# EAGLE design k1-v40 (EAGLE 5.01)

## Sheet 1 of 4
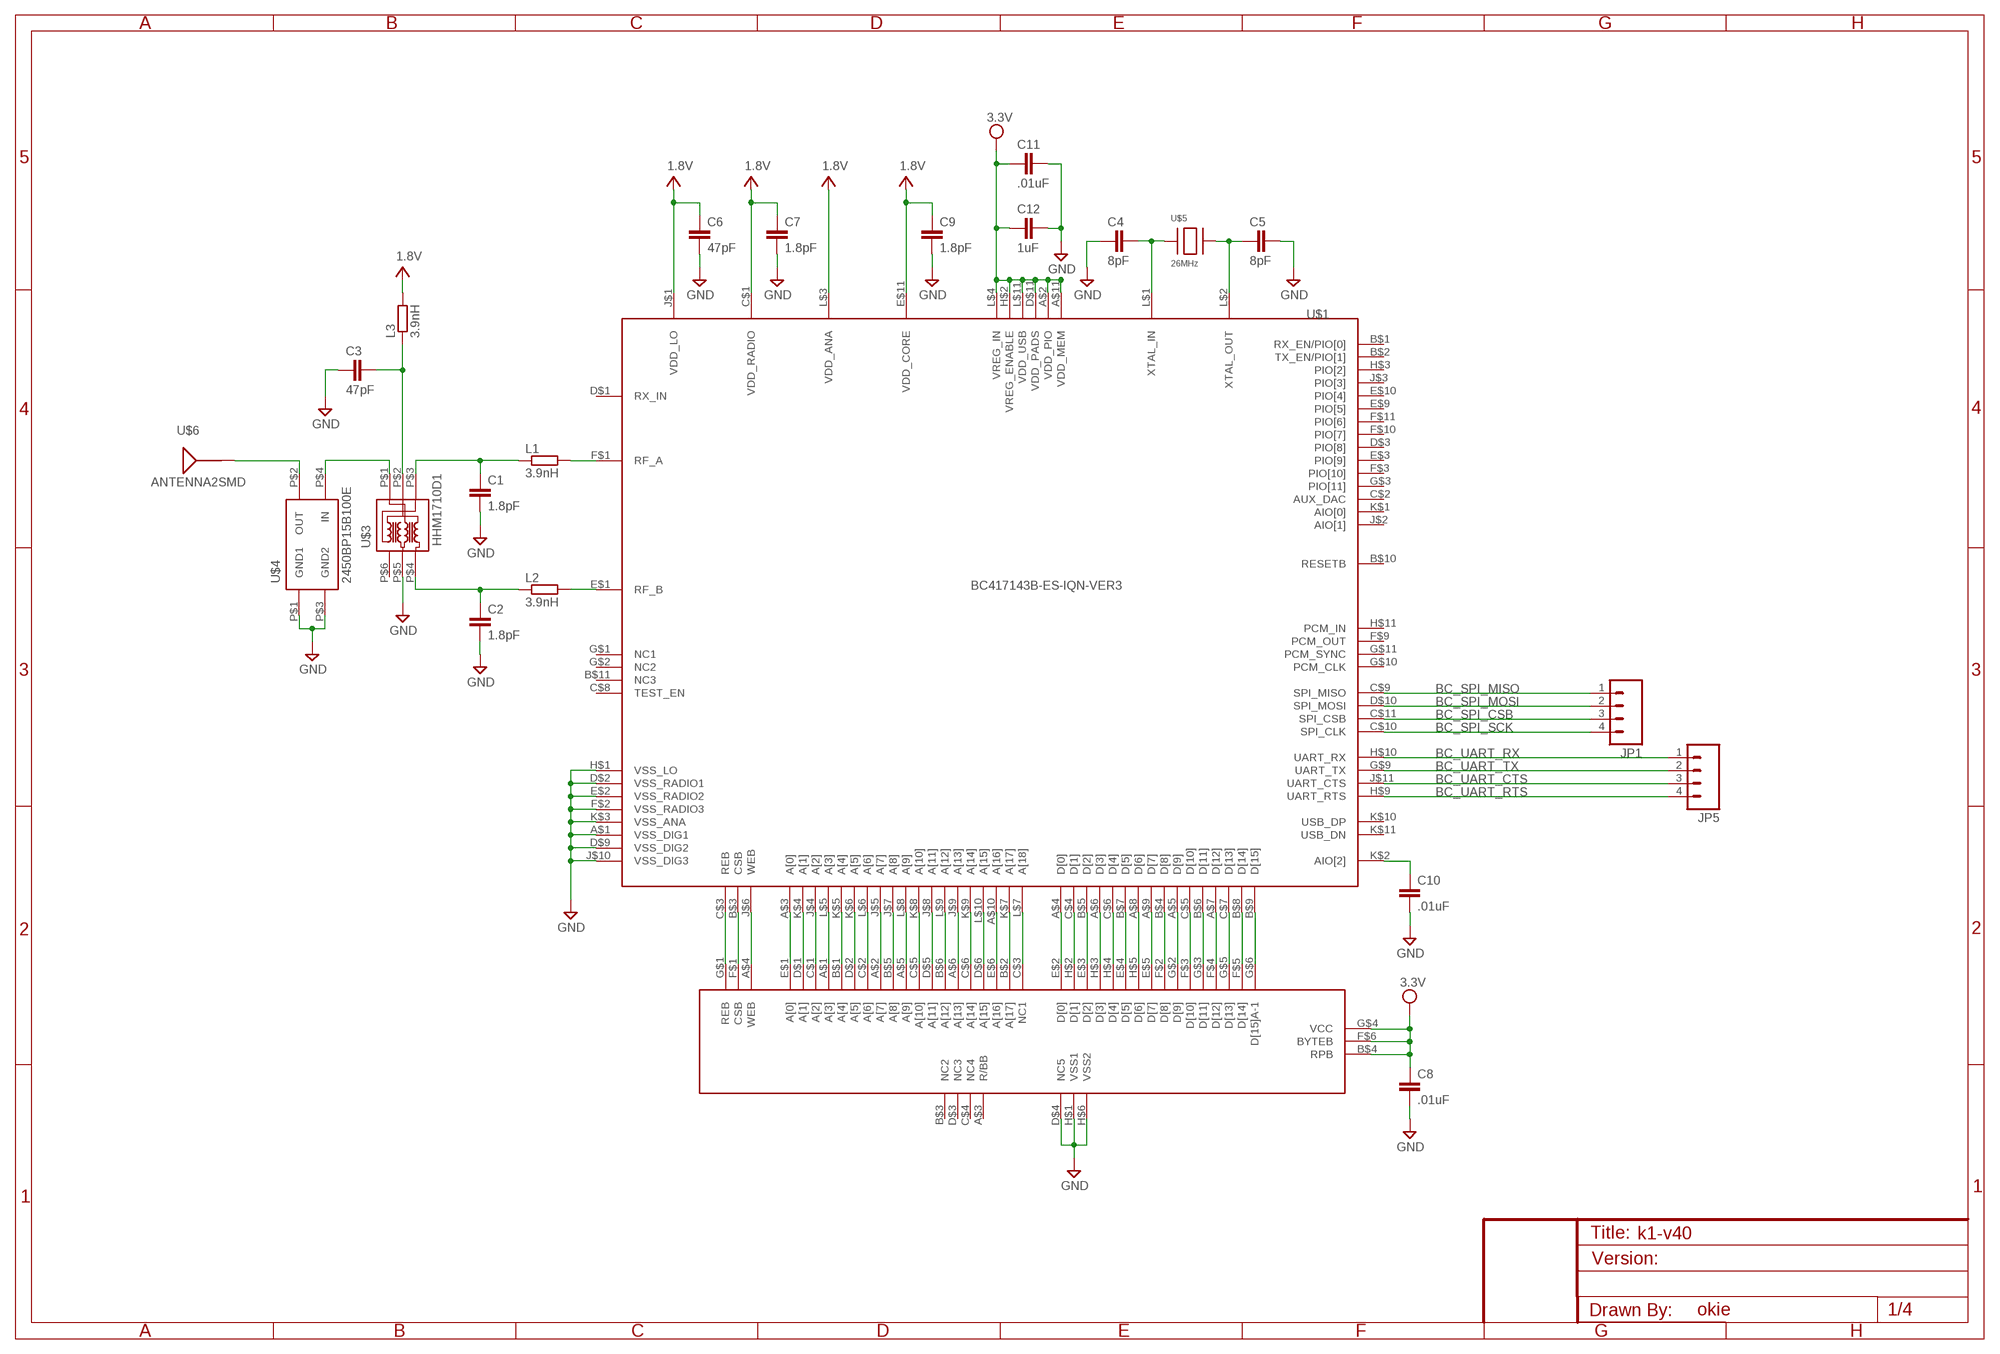
[diagram p0: schematic, sheet 1]

### Parts
C1  1.8pF  C-EUC0402  [C0402]
C2  1.8pF  C-EUC0402  [C0402]
C3  47pF  C-EUC0402  [C0402]
C4  8pF  C-EUC0402  [C0402]
C5  8pF  C-EUC0402  [C0402]
C6  47pF  C-EUC0402  [C0402]
C7  1.8pF  C-EUC0402  [C0402]
C8  .01uF  C-EUC0402  [C0402]
C9  1.8pF  C-EUC0402  [C0402]
C10  .01uF  C-EUC0402  [C0402]
C11  .01uF  C-EUC0402  [C0402]
C12  1uF  C-EUC0805  [C0805]
JP1  M04PTH  [1X04]
JP5  M04PTH  [1X04]
L1  3.9nH  R-EU_R0402  [R0402]
L2  3.9nH  R-EU_R0402  [R0402]
L3  3.9nH  R-EU_R0402  [R0402]
U$1  BC417143B-ES-IQN-VER3  [96-TFBGA-VER3]
U$2  M29W800DB  [48-TFBGA]
U$3  HHM1710D1  [HHM1710D1]
U$4  2450BP15B100E  [2450BP15B100E]
U$5  26MHz  3.2X2.5XTAL  [3.2X2.5XTAL]
U$6  ANTENNA2SMD  [ANTENNA-CHIP2]

### Nets
1.8V: C6.1 C7.1 C9.1 L3.2 U$1.C$1(VDD_RADIO) U$1.E$11(VDD_CORE) U$1.J$1(VDD_LO) U$1.L$3(VDD_ANA)
3.3V [vcc]: C8.1 C11.1 C12.1 U$1.A$2(VDD_PIO) U$1.A$11(VDD_MEM) U$1.D$11(VDD_PADS) U$1.H$2(VREG_ENABLE) U$1.L$4(VREG_IN) U$1.L$11(VDD_USB) U$2.B$4(RPB) U$2.F$6(BYTEB) U$2.G$4(VCC) ; also sheet 2,3,4
BC_SPI_CSB: JP1.3 U$1.C$11(SPI_CSB)
BC_SPI_MISO: JP1.1 U$1.C$9(SPI_MISO)
BC_SPI_MOSI: JP1.2 U$1.D$10(SPI_MOSI)
BC_SPI_SCK: JP1.4 U$1.C$10(SPI_CLK)
BC_UART_CTS: JP5.3 U$1.J$11(UART_CTS) ; also sheet 2
BC_UART_RTS: JP5.4 U$1.H$9(UART_RTS) ; also sheet 2
BC_UART_RX: JP5.1 U$1.H$10(UART_RX) ; also sheet 2
BC_UART_TX: JP5.2 U$1.G$9(UART_TX) ; also sheet 2
GND: C1.2 C2.2 C3.1 C4.1 C5.2 C6.2 C7.2 C8.2 C9.2 C10.2 C11.2 C12.2 U$1.A$1(VSS_DIG1) U$1.D$2(VSS_RADIO1) U$1.D$9(VSS_DIG2) U$1.E$2(VSS_RADIO2) U$1.F$2(VSS_RADIO3) U$1.H$1(VSS_LO) U$1.J$10(VSS_DIG3) U$1.K$3(VSS_ANA) U$2.D$4(NC5) U$2.H$1(VSS1) U$2.H$6(VSS2) U$3.P$5 U$4.P$1(GND1) U$4.P$3(GND2) ; also sheet 2,3,4
N$1: U$1.C$3(REB) U$2.G$1(REB)
N$2: U$1.B$3(CSB) U$2.F$1(CSB)
N$3: U$1.J$6(WEB) U$2.A$4(WEB)
N$4: U$1.A$3(A[0]) U$2.E$1(A[0])
N$5: U$1.K$4(A[1]) U$2.D$1(A[1])
N$6: U$1.J$4(A[2]) U$2.C$1(A[2])
N$7: U$1.L$5(A[3]) U$2.A$1(A[3])
N$8: U$1.K$5(A[4]) U$2.B$1(A[4])
N$9: U$1.K$6(A[5]) U$2.D$2(A[5])
N$10: U$1.L$6(A[6]) U$2.C$2(A[6])
N$11: U$1.J$5(A[7]) U$2.A$2(A[7])
N$12: U$1.J$7(A[8]) U$2.B$5(A[8])
N$13: U$1.L$8(A[9]) U$2.A$5(A[9])
N$14: U$1.K$8(A[10]) U$2.C$5(A[10])
N$15: U$1.J$8(A[11]) U$2.D$5(A[11])
N$16: U$1.L$9(A[12]) U$2.B$6(A[12])
N$17: U$1.J$9(A[13]) U$2.A$6(A[13])
N$18: U$1.K$9(A[14]) U$2.C$6(A[14])
N$19: U$1.L$10(A[15]) U$2.D$6(A[15])
N$20: U$1.A$10(A[16]) U$2.E$6(A[16])
N$21: U$1.K$7(A[17]) U$2.B$2(A[17])
N$22: U$1.L$7(A[18]) U$2.C$3(NC1)
N$23: U$1.A$4(D[0]) U$2.E$2(D[0])
N$24: U$1.C$4(D[1]) U$2.H$2(D[1])
N$25: U$1.B$5(D[2]) U$2.E$3(D[2])
N$26: U$1.A$6(D[3]) U$2.H$3(D[3])
N$27: U$1.C$6(D[4]) U$2.H$4(D[4])
N$28: U$1.B$7(D[5]) U$2.E$4(D[5])
N$29: U$1.A$8(D[6]) U$2.H$5(D[6])
N$30: U$1.A$9(D[7]) U$2.E$5(D[7])
N$31: U$1.B$4(D[8]) U$2.F$2(D[8])
N$32: U$1.A$5(D[9]) U$2.G$2(D[9])
N$33: U$1.C$5(D[10]) U$2.F$3(D[10])
N$34: U$1.B$6(D[11]) U$2.G$3(D[11])
N$35: U$1.A$7(D[12]) U$2.F$4(D[12])
N$36: U$1.C$7(D[13]) U$2.G$5(D[13])
N$37: U$1.B$8(D[14]) U$2.F$5(D[14])
N$38: U$1.B$9(D[15]) U$2.G$6(D[15]A-1)
N$39: C1.1 L1.1 U$3.P$3
N$40: L1.2 U$1.F$1(RF_A)
N$41: L2.2 U$1.E$1(RF_B)
N$42: C2.1 L2.1 U$3.P$4
N$43: C3.2 L3.1 U$3.P$2
N$44: U$3.P$1 U$4.P$4(IN)
N$45: C4.2 U$1.L$1(XTAL_IN) U$5.P$1
N$46: C5.1 U$1.L$2(XTAL_OUT) U$5.P$3
N$47: C10.1 U$1.K$2(AIO[2])
N$62: U$4.P$2(OUT) U$6.FEED(SIGNAL)
Unconnected: U$1.B$1(RX_EN/PIO[0]) U$1.B$2(TX_EN/PIO[1]) U$1.B$10(RESETB) U$1.B$11(NC3) U$1.C$2(AUX_DAC) U$1.C$8(TEST_EN) U$1.D$1(RX_IN) U$1.D$3(PIO[8]) U$1.E$3(PIO[9]) U$1.E$9(PIO[5]) U$1.E$10(PIO[4]) U$1.F$3(PIO[10]) U$1.F$9(PCM_OUT) U$1.F$10(PIO[7]) U$1.F$11(PIO[6]) U$1.G$1(NC1) U$1.G$2(NC2) U$1.G$3(PIO[11]) U$1.G$10(PCM_CLK) U$1.G$11(PCM_SYNC) U$1.H$3(PIO[2]) U$1.H$11(PCM_IN) U$1.J$2(AIO[1]) U$1.J$3(PIO[3]) U$1.K$1(AIO[0]) U$1.K$10(USB_DP) U$1.K$11(USB_DN) U$2.A$3(R/BB) U$2.B$3(NC2) U$2.C$4(NC4) U$2.D$3(NC3) U$3.P$6

### Notes on the sheet
- okie

## Sheet 2 of 4
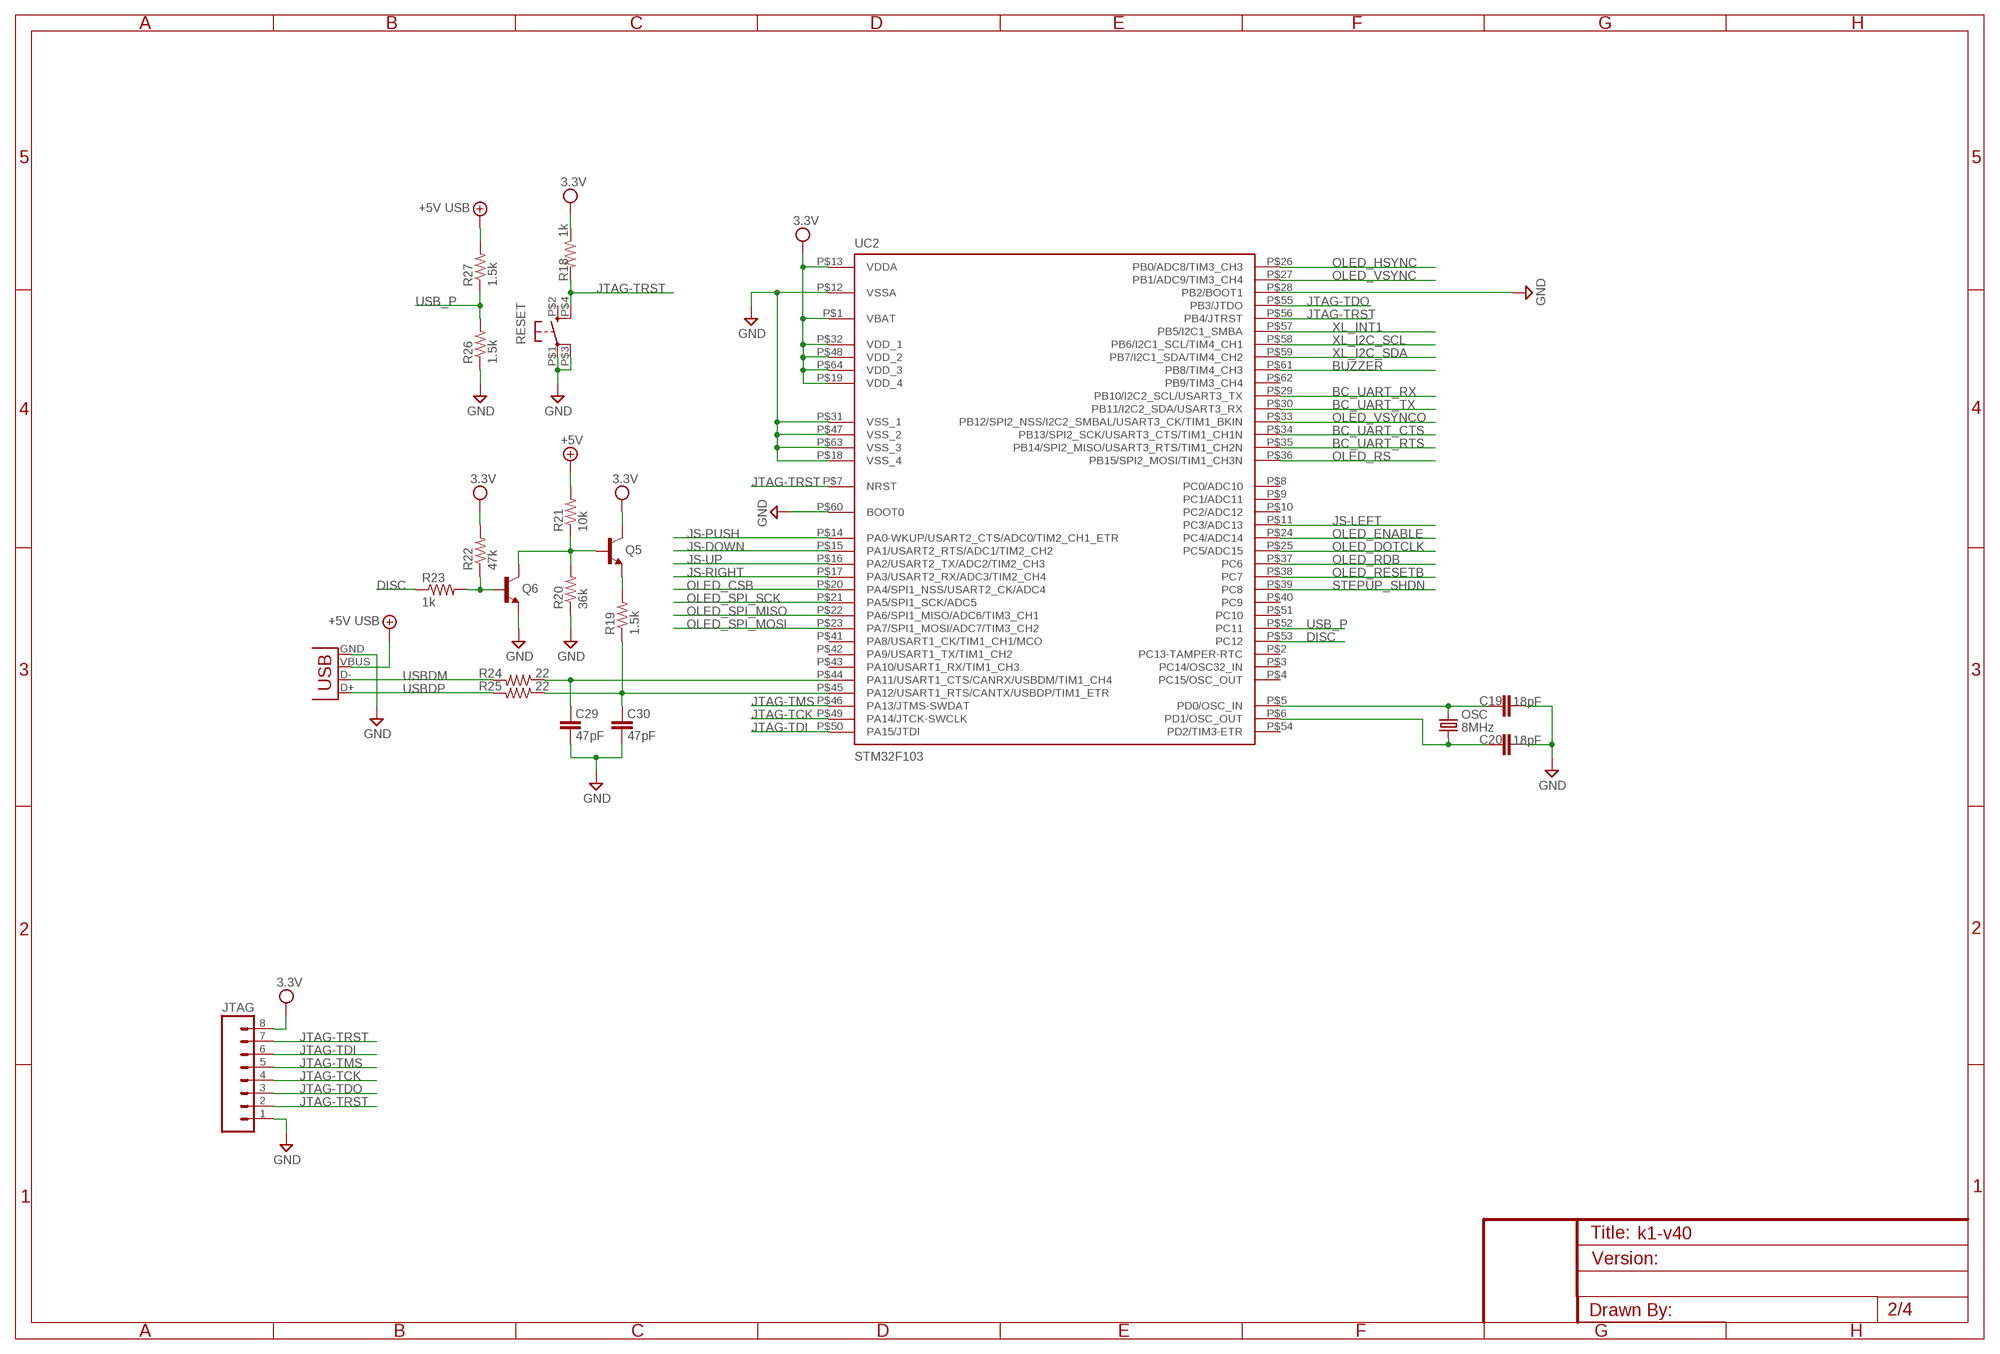
[diagram p1: schematic, sheet 2]

### Parts
C19  18pF  CAP0402  [C0402]
C20  18pF  CAP0402  [C0402]
C29  47pF  CAP0402  [C0402]
C30  47pF  CAP0402  [C0402]
JTAG  M08  [1X08]
OSC  8MHz  CRYSTAL5X3  [CRYSTAL-SMD-5X3]
Q5  TRANSISTOR_NPNSOT23  [SOT23]
Q6  TRANSISTOR_NPNSOT23  [SOT23]
R18  1k  RESISTOR0402  [C0402]
R19  1.5k  RESISTOR0402  [C0402]
R20  36k  RESISTOR0402  [C0402]
R21  10k  RESISTOR0402  [C0402]
R22  47k  RESISTOR0402  [C0402]
R23  1k  RESISTOR0402  [C0402]
R24  22  RESISTOR0402  [C0402]
R25  22  RESISTOR0402  [C0402]
R26  1.5k  RESISTOR0402  [C0402]
R27  1.5k  RESISTOR0402  [C0402]
RESET  BUTTON-KMR241GLFS  [PUSHBUTTON-KMR241GLFS]
UC2  STM32F103  [TQFP-10X10-64]
X1  USBSMD  [USB-MINIB]

### Nets
3.3V [vcc]: JTAG.8 Q5.3(C) R18.1 R22.2 UC2.P$1(VBAT) UC2.P$13(VDDA) UC2.P$19(VDD_4) UC2.P$32(VDD_1) UC2.P$48(VDD_2) UC2.P$64(VDD_3) ; also sheet 1,3,4
+5V: R21.2 R27.2 X1.VBUS ; supply symbol labelled +5V USB ; also sheet 4
BC_UART_CTS: UC2.P$34(PB13/SPI2_SCK/USART3_CTS/TIM1_CH1N) ; also sheet 1
BC_UART_RTS: UC2.P$35(PB14/SPI2_MISO/USART3_RTS/TIM1_CH2N) ; also sheet 1
BC_UART_RX: UC2.P$29(PB10/I2C2_SCL/USART3_TX) ; also sheet 1
BC_UART_TX: UC2.P$30(PB11/I2C2_SDA/USART3_RX) ; also sheet 1
BUZZER: UC2.P$61(PB8/TIM4_CH3) ; also sheet 3
DISC: R23.1 UC2.P$53(PC12)
GND: C19.1 C20.1 C29.1 C30.1 JTAG.1 Q6.2(E) R20.1 R26.1 RESET.P$1 RESET.P$3 UC2.P$12(VSSA) UC2.P$18(VSS_4) UC2.P$28(PB2/BOOT1) UC2.P$31(VSS_1) UC2.P$47(VSS_2) UC2.P$60(BOOT0) UC2.P$63(VSS_3) X1.GND ; also sheet 1,3,4
JS-DOWN: UC2.P$15(PA1/USART2_RTS/ADC1/TIM2_CH2) ; also sheet 3
JS-LEFT: UC2.P$11(PC3/ADC13) ; also sheet 3
JS-PUSH: UC2.P$14(PA0-WKUP/USART2_CTS/ADC0/TIM2_CH1_ETR) ; also sheet 3
JS-RIGHT: UC2.P$17(PA3/USART2_RX/ADC3/TIM2_CH4) ; also sheet 3
JS-UP: UC2.P$16(PA2/USART2_TX/ADC2/TIM2_CH3) ; also sheet 3
JTAG-TCK: JTAG.4 UC2.P$49(PA14/JTCK-SWCLK)
JTAG-TDI: JTAG.6 UC2.P$50(PA15/JTDI)
JTAG-TDO: JTAG.3 UC2.P$55(PB3/JTDO)
JTAG-TMS: JTAG.5 UC2.P$46(PA13/JTMS-SWDAT)
JTAG-TRST: JTAG.2 JTAG.7 R18.2 RESET.P$4 UC2.P$7(NRST) UC2.P$56(PB4/JTRST)
N$53: C19.2 OSC.3 UC2.P$5(PD0/OSC_IN)
N$54: C20.2 OSC.1 UC2.P$6(PD1/OSC_OUT)
N$55: Q5.2(E) R19.2
N$67: Q5.1(B) Q6.3(C) R20.2 R21.1
N$69: Q6.1(B) R22.1 R23.2
N$70: C29.2 R24.1 UC2.P$44(PA11/USART1_CTS/CANRX/USBDM/TIM1_CH4)
N$72: C30.2 R19.1 R25.1 UC2.P$45(PA12/USART1_RTS/CANTX/USBDP/TIM1_ETR)
OLED_CSB: UC2.P$20(PA4/SPI1_NSS/USART2_CK/ADC4) ; also sheet 3
OLED_DOTCLK: UC2.P$25(PC5/ADC15) ; also sheet 3
OLED_ENABLE: UC2.P$24(PC4/ADC14) ; also sheet 3
OLED_HSYNC: UC2.P$26(PB0/ADC8/TIM3_CH3) ; also sheet 3
OLED_RDB: UC2.P$37(PC6) ; also sheet 3
OLED_RESETB: UC2.P$38(PC7) ; also sheet 3
OLED_RS: UC2.P$36(PB15/SPI2_MOSI/TIM1_CH3N) ; also sheet 3
OLED_SPI_MISO: UC2.P$22(PA6/SPI1_MISO/ADC6/TIM3_CH1) ; also sheet 3
OLED_SPI_MOSI: UC2.P$23(PA7/SPI1_MOSI/ADC7/TIM3_CH2) ; also sheet 3
OLED_SPI_SCK: UC2.P$21(PA5/SPI1_SCK/ADC5) ; also sheet 3
OLED_VSYNC: UC2.P$27(PB1/ADC9/TIM3_CH4) ; also sheet 3
OLED_VSYNCO: UC2.P$33(PB12/SPI2_NSS/I2C2_SMBAL/USART3_CK/TIM1_BKIN) ; also sheet 3
STEPUP_SHDN: UC2.P$39(PC8) ; also sheet 4
USB_P: R26.2 R27.1 UC2.P$52(PC11)
USBDM: R24.2 X1.D-
USBDP: R25.2 X1.D+
XL_I2C_SCL: UC2.P$58(PB6/I2C1_SCL/TIM4_CH1) ; also sheet 3
XL_I2C_SDA: UC2.P$59(PB7/I2C1_SDA/TIM4_CH2) ; also sheet 3
XL_INT1: UC2.P$57(PB5/I2C1_SMBA) ; also sheet 3
Unconnected: RESET.P$2 UC2.P$2(PC13-TAMPER-RTC) UC2.P$3(PC14/OSC32_IN) UC2.P$4(PC15/OSC_OUT) UC2.P$8(PC0/ADC10) UC2.P$9(PC1/ADC11) UC2.P$10(PC2/ADC12) UC2.P$40(PC9) UC2.P$41(PA8/USART1_CK/TIM1_CH1/MCO) UC2.P$42(PA9/USART1_TX/TIM1_CH2) UC2.P$43(PA10/USART1_RX/TIM1_CH3) UC2.P$51(PC10) UC2.P$54(PD2/TIM3-ETR) UC2.P$62(PB9/TIM3_CH4)

## Sheet 3 of 4
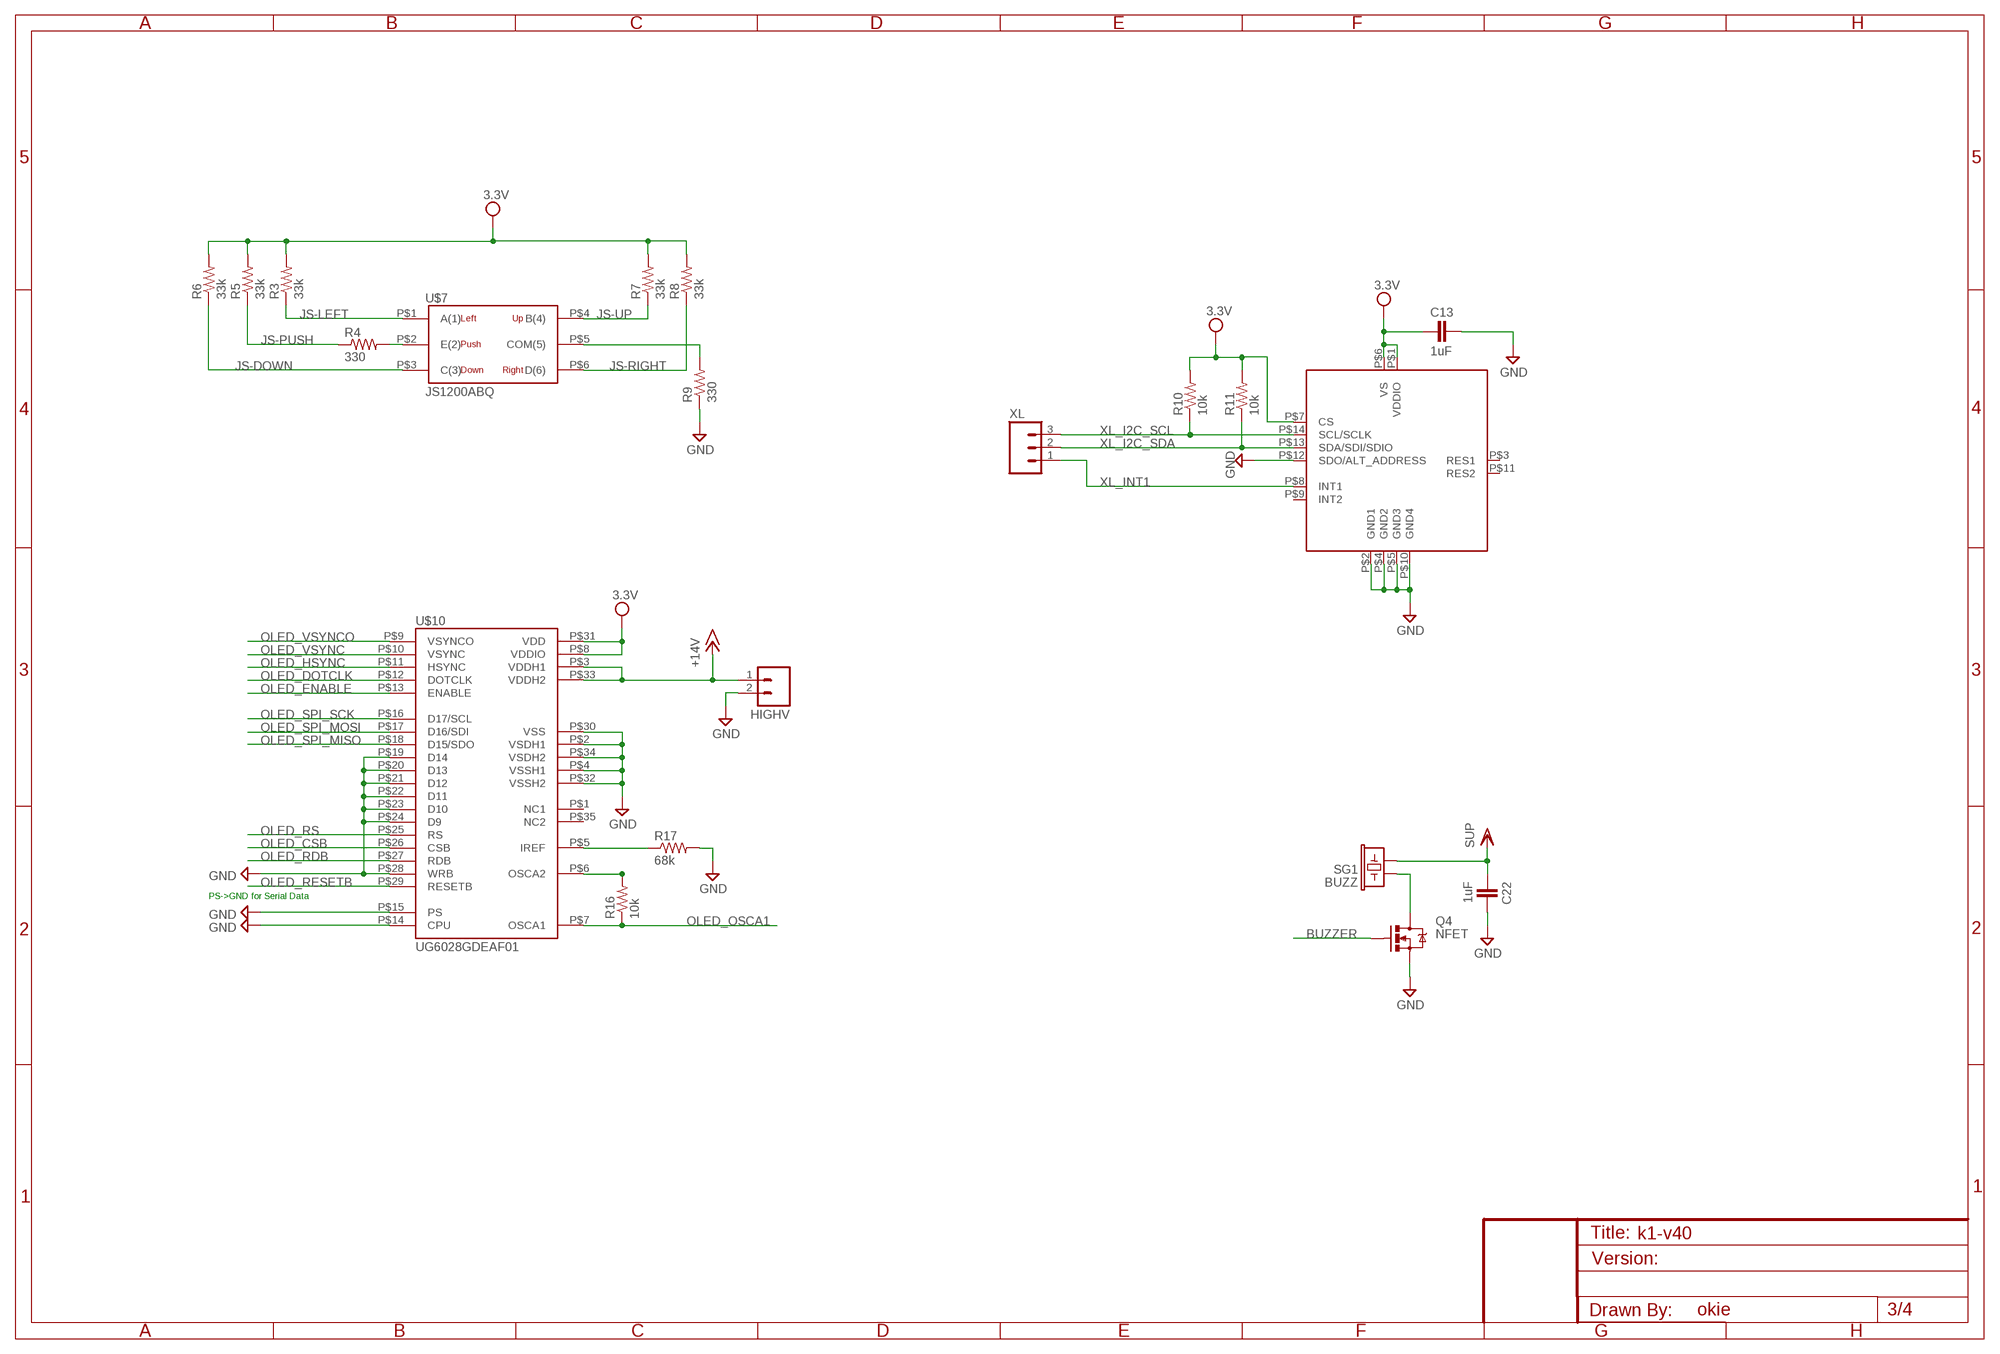
[diagram p2: schematic, sheet 3]

### Parts
C13  1uF  C-EUC0402  [C0402]
C22  1uF  C-EUC0402  [C0402]
HIGHV  M02PTH  [1X02]
Q4  NFET  MOSFET-NCHANNELSMD  [SOT23-3]
R3  33k  R-US_R0402  [R0402]
R4  330  R-US_R0402  [R0402]
R5  33k  R-US_R0402  [R0402]
R6  33k  R-US_R0402  [R0402]
R7  33k  R-US_R0402  [R0402]
R8  33k  R-US_R0402  [R0402]
R9  330  R-US_R0402  [R0402]
R10  10k  R-US_R0402  [R0402]
R11  10k  R-US_R0402  [R0402]
R16  10k  R-US_R0402  [R0402]
R17  68k  R-US_R0402  [R0402]
SG1  BUZZ  BUZZERPTH  [BUZZER-12MM]
U$7  JS1200ABQ  [JS1200ABQ]
U$10  UG6028GDEAF01  [UG6028GDEAF01]
U$11  ADXL345-PUBLIC  [LFCSP14]
XL  M03PTH  [1X03]

### Nets
3.3V [vcc]: C13.1 R3.2 R5.2 R6.2 R7.2 R8.2 R10.2 R11.2 U$10.P$8(VDDIO) U$10.P$31(VDD) U$11.P$1(VDDIO) U$11.P$6(VS) U$11.P$7(CS) ; also sheet 1,2,4
+15V: HIGHV.1 U$10.P$3(VDDH1) U$10.P$33(VDDH2) ; supply symbol labelled +14V ; also sheet 4
BUZZER: Q4.1(G) ; also sheet 2
GND: C13.2 C22.2 HIGHV.2 Q4.2(S) R9.1 R17.2 U$10.P$2(VSDH1) U$10.P$4(VSSH1) U$10.P$14(CPU) U$10.P$15(PS) U$10.P$19(D14) U$10.P$20(D13) U$10.P$21(D12) U$10.P$22(D11) U$10.P$23(D10) U$10.P$24(D9) U$10.P$28(WRB) U$10.P$30(VSS) U$10.P$32(VSSH2) U$10.P$34(VSDH2) U$11.P$2(GND1) U$11.P$4(GND2) U$11.P$5(GND3) U$11.P$10(GND4) U$11.P$12(SDO/ALT_ADDRESS) ; also sheet 1,2,4
JS-DOWN: R6.1 U$7.P$3(C(3)) ; also sheet 2
JS-LEFT: R3.1 U$7.P$1(A(1)) ; also sheet 2
JS-PUSH: R4.1 R5.1 ; also sheet 2
JS-RIGHT: R8.1 U$7.P$6(D(6)) ; also sheet 2
JS-UP: R7.1 U$7.P$4(B(4)) ; also sheet 2
N$58: R4.2 U$7.P$2(E(2))
N$63: R17.1 U$10.P$5(IREF)
N$64: Q4.3(D) SG1.-
N$66: R9.2 U$7.P$5(COM(5))
N$78: R16.2 U$10.P$6(OSCA2)
OLED_CSB: U$10.P$26(CSB) ; also sheet 2
OLED_DOTCLK: U$10.P$12(DOTCLK) ; also sheet 2
OLED_ENABLE: U$10.P$13(ENABLE) ; also sheet 2
OLED_HSYNC: U$10.P$11(HSYNC) ; also sheet 2
OLED_OSCA1: R16.1 U$10.P$7(OSCA1)
OLED_RDB: U$10.P$27(RDB) ; also sheet 2
OLED_RESETB: U$10.P$29(RESETB) ; also sheet 2
OLED_RS: U$10.P$25(RS) ; also sheet 2
OLED_SPI_MISO: U$10.P$18(D15/SDO) ; also sheet 2
OLED_SPI_MOSI: U$10.P$17(D16/SDI) ; also sheet 2
OLED_SPI_SCK: U$10.P$16(D17/SCL) ; also sheet 2
OLED_VSYNC: U$10.P$10(VSYNC) ; also sheet 2
OLED_VSYNCO: U$10.P$9(VSYNCO) ; also sheet 2
SUP: C22.1 SG1.+ ; also sheet 4
XL_I2C_SCL: R10.1 U$11.P$14(SCL/SCLK) XL.3 ; also sheet 2
XL_I2C_SDA: R11.1 U$11.P$13(SDA/SDI/SDIO) XL.2 ; also sheet 2
XL_INT1: U$11.P$8(INT1) XL.1 ; also sheet 2
Unconnected: U$10.P$1(NC1) U$10.P$35(NC2) U$11.P$3(RES1) U$11.P$9(INT2) U$11.P$11(RES2)

### Notes on the sheet
- PS->GND for Serial Data
- okie

## Sheet 4 of 4
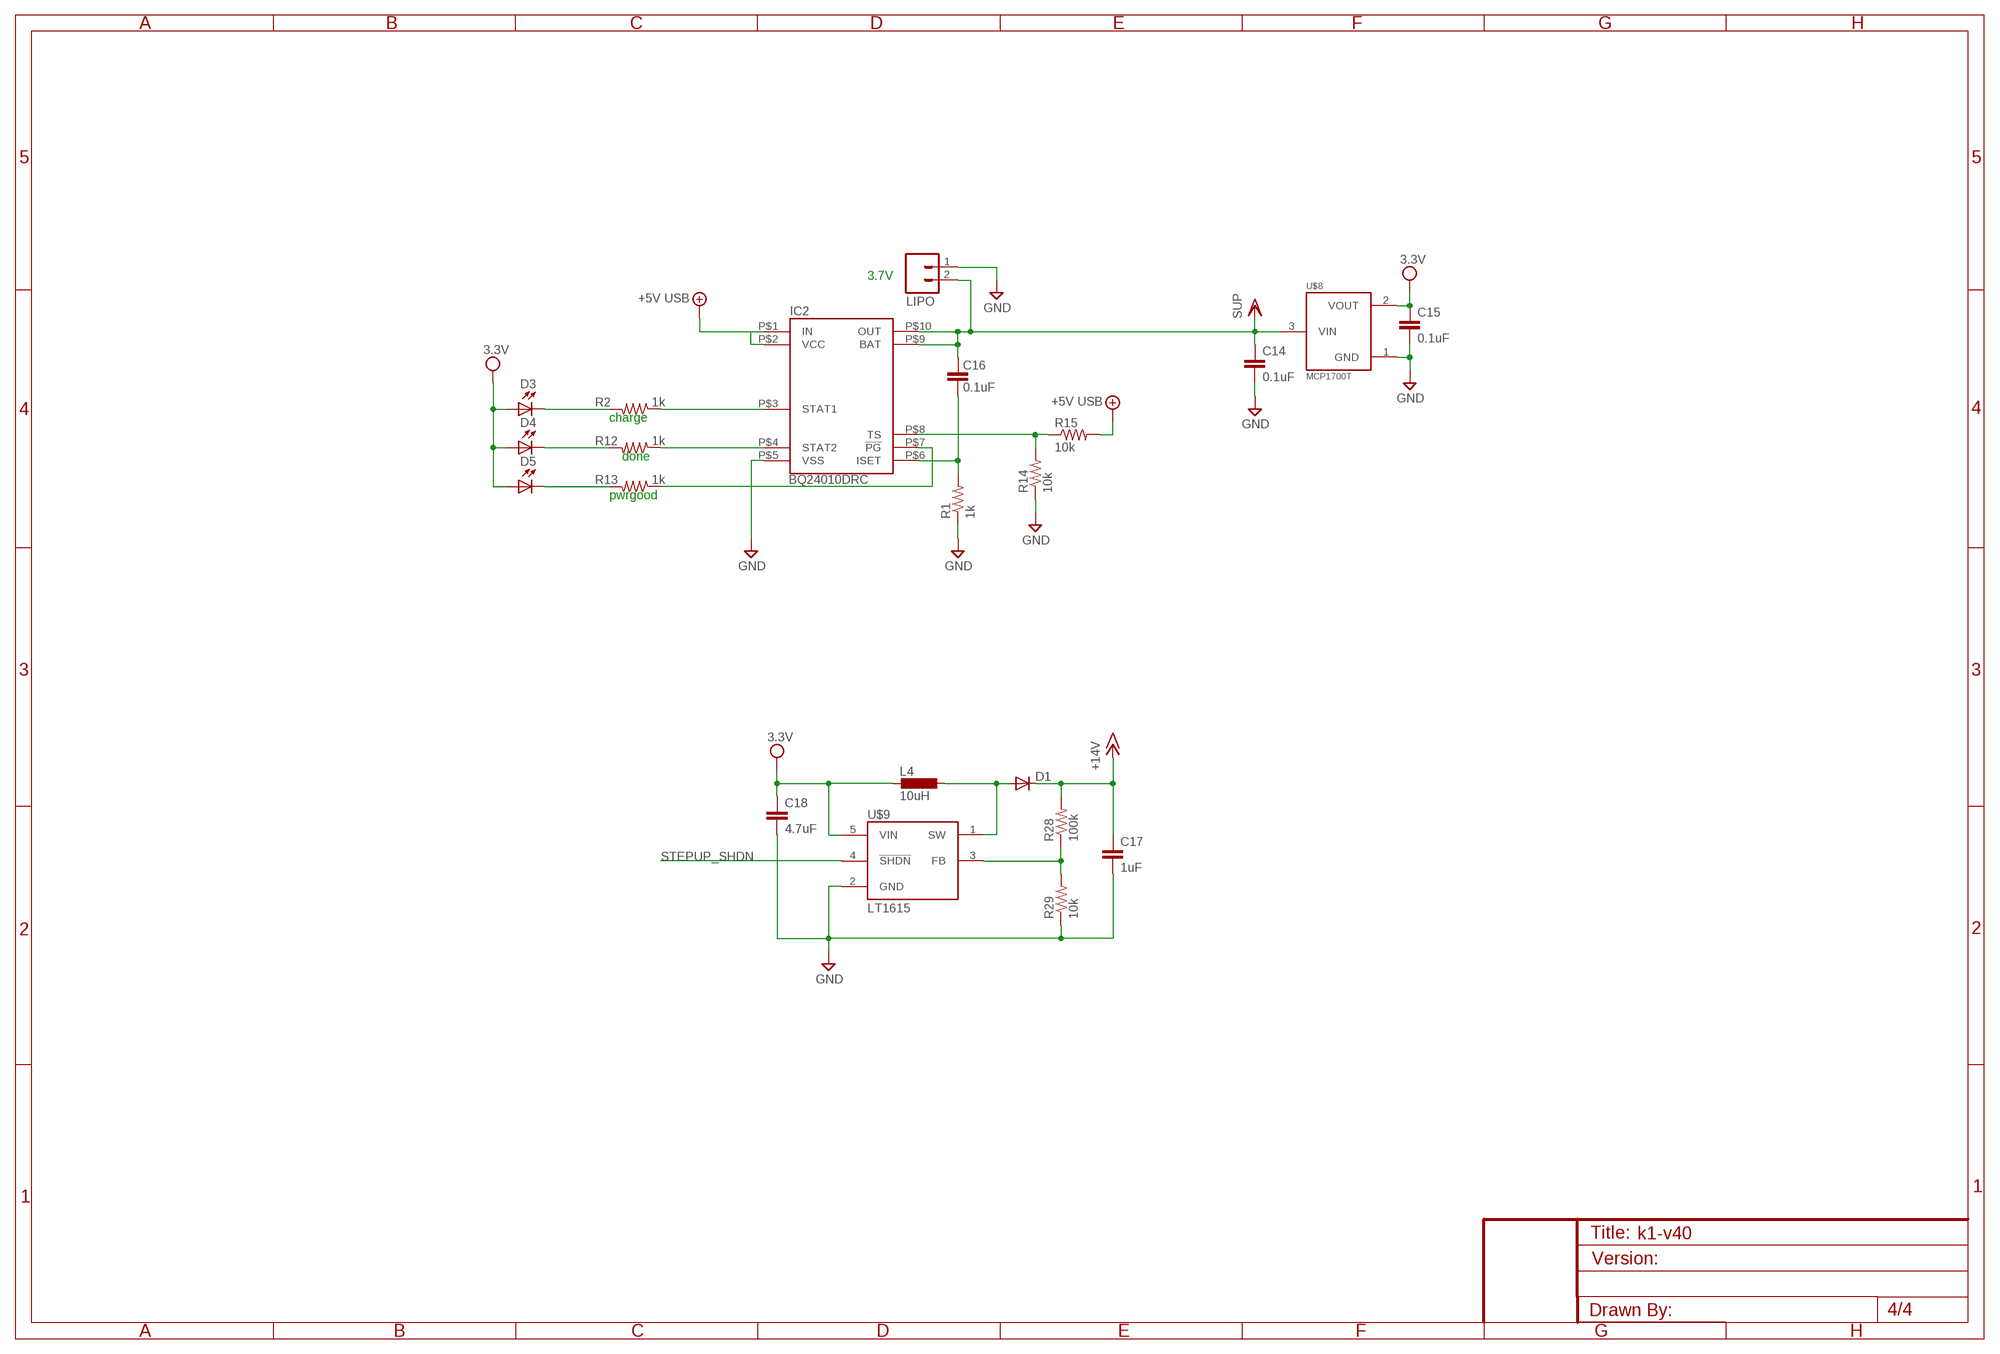
[diagram p3: schematic, sheet 4]

### Parts
C14  0.1uF  C-EUC0402  [C0402]
C15  0.1uF  C-EUC0402  [C0402]
C16  0.1uF  CAP0402  [C0402]
C17  1uF  C-EUC1206  [C1206]
C18  4.7uF  C-EUC1206  [C1206]
D1  DIODESOD  [SOD-323]
D3  LED0603  [LED-0603]
D4  LED0603  [LED-0603]
D5  LED0603  [LED-0603]
IC2  BQ24010DRC  [PSON10-V3]
L4  10uH  L-EUL1812  [L1812]
LIPO  M02PTH  [1X02]
R1  1k  RESISTOR0402  [C0402]
R2  1k  RESISTOR0402  [C0402]
R12  1k  RESISTOR0402  [C0402]
R13  1k  RESISTOR0402  [C0402]
R14  10k  RESISTOR0402  [C0402]
R15  10k  RESISTOR0402  [C0402]
R28  100k  RESISTOR0402  [C0402]
R29  10k  RESISTOR0402  [C0402]
U$8  MCP1700T  [SOT23]
U$9  LT1615  [SOT23-5]

### Nets
3.3V [vcc]: C15.1 C18.1 D3.A D4.A D5.A L4.2 U$8.2(VOUT) U$9.5(VIN) ; also sheet 1,2,3
+5V: IC2.P$1(IN) IC2.P$2(VCC) R15.2 ; supply symbol labelled +5V USB ; also sheet 2
+15V: C17.1 D1.1(C) R28.2 ; supply symbol labelled +14V ; also sheet 3
GND: C14.2 C15.2 C17.2 C18.2 IC2.P$5(VSS) LIPO.1 R1.1 R14.1 R29.1 U$8.1(GND) U$9.2(GND) ; also sheet 1,2,3
N$48: C16.1 IC2.P$6(ISET) R1.2
N$49: IC2.P$7(!PG) R13.1
N$50: D5.C R13.2
N$51: D4.C R12.2
N$52: D3.C R2.2
N$56: IC2.P$3(STAT1) R2.1
N$57: IC2.P$4(STAT2) R12.1
N$59: D1.2(A) L4.1 U$9.1(SW)
N$60: IC2.P$8(TS) R14.2 R15.1
N$61: R28.1 R29.2 U$9.3(FB)
STEPUP_SHDN: U$9.4(!SHDN) ; also sheet 2
SUP: C14.1 C16.2 IC2.P$9(BAT) IC2.P$10(OUT) LIPO.2 U$8.3(VIN) ; also sheet 3

### Notes on the sheet
- 3.7V
- charge
- done
- pwrgood

## Library data of the parts
C1-C15 C17 C18 C22 = rcl:C-EU: CAPACITOR, European symbol
C16 C19 C20 C29 C30 = SparkFun:CAP: Capacitor Standard 0603 ceramic capacitor, and 0.1" leaded capacitor.
D1 = SparkFun2:DIODE: Diode These are standard reverse protection diodes and small signal diodes. SMA package can handle up to about 1A. SOD-323 can handle about 200mA. What the SOD-323 package when ordering, there are some mfgs out there that are 5-pin packages.
D3-D5 = SparkFun:LED: LEDs Standard schematic elements and footprints for 5mm, 3mm, 1206, and 0603 sized LEDs. 5mm - Spark Fun Electronics SKU : COM-00529 (and others)
HIGHV LIPO = SparkFun2:M02: Header 2 Standard 2-pin 0.1" header. Use with straight break away headers (SKU : PRT-00116), right angle break away headers (PRT-00553), swiss pins (PRT-00743), machine pins (PRT-00117), and female headers (PRT-00115). Molex polarized connector foot print use with SKU : PRT-08233 with associated crimp pins and housings.
IC2 = okie:BQ24010DRC
JP1 JP5 = SparkFun2:M04: Header 4 Standard 4-pin 0.1" header. Use with straight break away headers (SKU : PRT-00116), right angle break away headers (PRT-00553), swiss pins (PRT-00743), machine pins (PRT-00117), and female headers (PRT-00115). Molex polarized connector foot print use with SKU : PRT-08231 with associated crimp pins and housings.
JTAG = SparkFun2:M08: Header 8 Standard 8-pin 0.1" header. Use with straight break away headers (SKU : PRT-00116), right angle break away headers (PRT-00553), swiss pins (PRT-00743), machine pins (PRT-00117), and female headers (PRT-00115).
L1-L3 = rcl:R-EU_: RESISTOR, European symbol
L4 = rcl:L-EU: INDUCTOR, European symbol
OSC = SparkFun2:CRYSTAL: Crystals Various standard crystals. Proven footprints. Spark Fun Electronics SKU : COM-00534
Q4 = SparkFun2:MOSFET-NCHANNEL
Q5 Q6 = SparkFun2:TRANSISTOR_NPN: Transistor NPN BJT configuration in SOT23 package. MMBT2222 is the common NPN we use. Double check BCE configuration again layout.
R1 R2 R12-R15 R18-R29 = SparkFun:RESISTOR: Resistor Basic schematic elements and footprints for 0603, 1206, and PTH 1/10th watt (small) resistors.
R3-R11 R16 R17 = rcl:R-US_: RESISTOR, American symbol
RESET = okie:BUTTON-KMR241GLFS
SG1 = SparkFun2:BUZZER: Buzzer 12mm Spark Fun Electronics SKU : Comp-Buzzer
U$1 = okie-adi:BC417143B-ES-IQN-VER3
U$2 = okie-adi:M29W800DB
U$3 = okie-adi:HHM1710D1
U$4 = okie-adi:2450BP15B100E
U$5 = okie-adi:3.2X2.5XTAL
U$6 = SparkFun2:ANTENNA2: Antenna Single endded antenna. Common with smaller chip antennas. CHIP4 package is the GPS Chip Antenna SKU: GPS-08418. CHIP5 package is 2.4GHz chip antenna SKU: WRL-00144.
U$7 = okie-adi:JS1200ABQ
U$8 = okie:MCP1700T
U$9 = okie:LT1615
U$10 = okie:UG6028GDEAF01
U$11 = jml:ADXL345-PUBLIC
UC2 = st-microelectronics:STM32F103
X1 = SparkFun2:USB: USB Connectors USB-B-PTH is fully proven SKU : PRT-00139 USB-miniB is fully proven SKU : PRT-00587 USB-A-PCB is untested. USB-A-H is throughly reviewed, but untested. Spark Fun Electronics SKU : PRT-00437 USB-B-SMT is throughly reviewed, but untested. Needs silkscreen touching up. USB-A-S has not been used/tested USB-MB-H has not been used/tested
XL = SparkFun2:M03: Header 3 Standard 3-pin 0.1" header. Use with straight break away headers (SKU : PRT-00116), right angle break away headers (PRT-00553), swiss pins (PRT-00743), machine pins (PRT-00117), and female headers (PRT-00115). Molex polarized connector foot print use with SKU : PRT-08232 with associated crimp pins and housings.

## Net classes
0 default: width 0.203 mm
1 vcc: width 0.254 mm

## Board
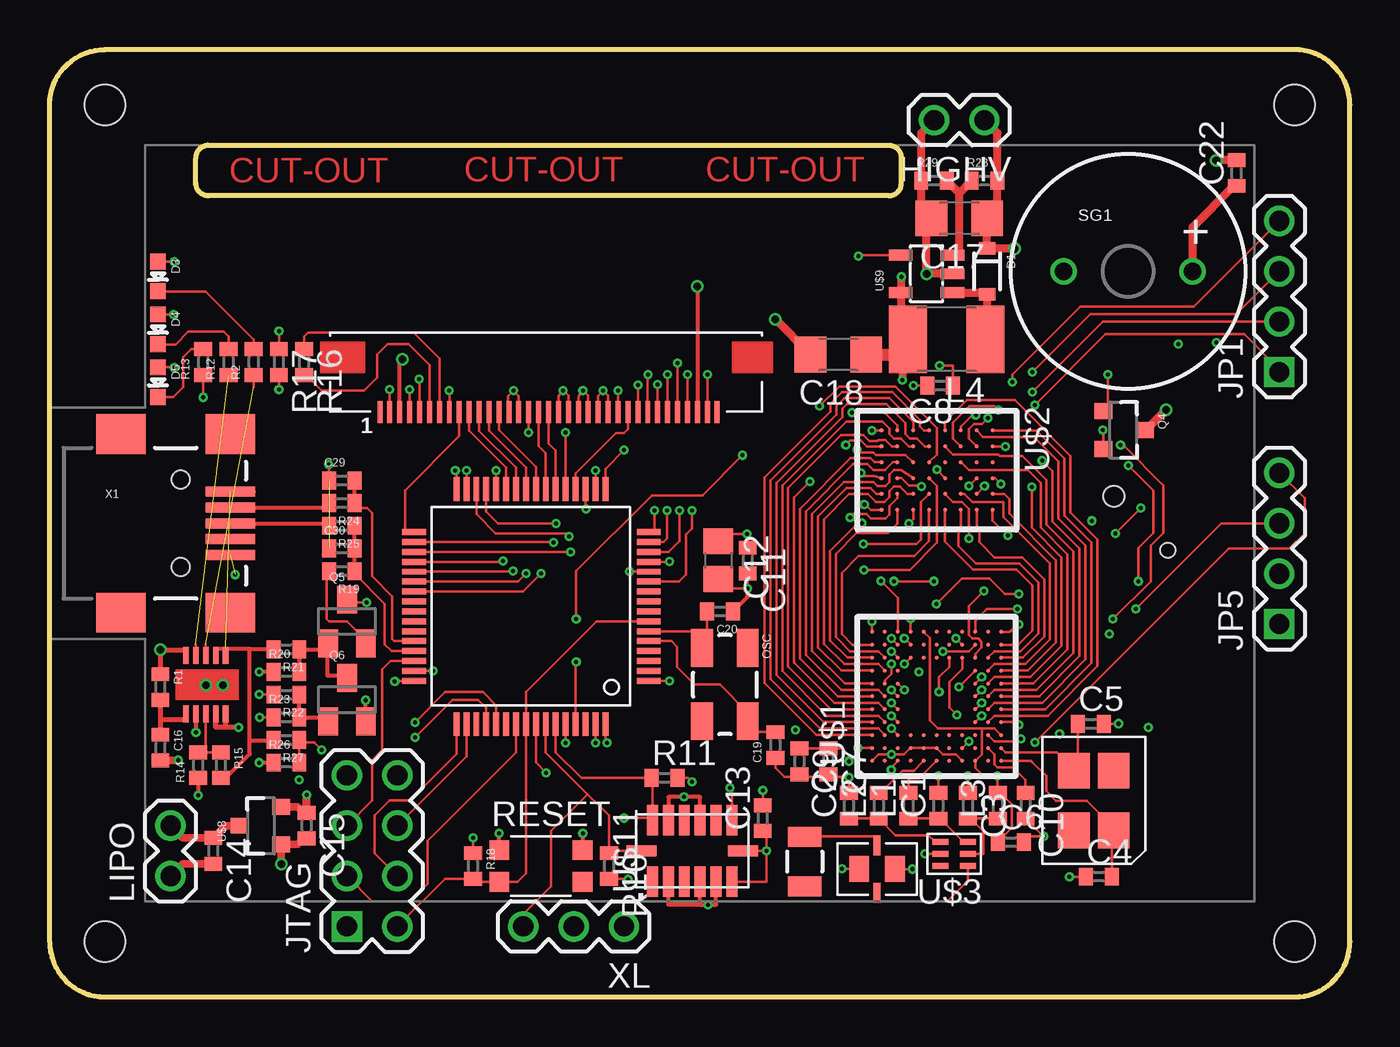
[diagram p4: board, top side]
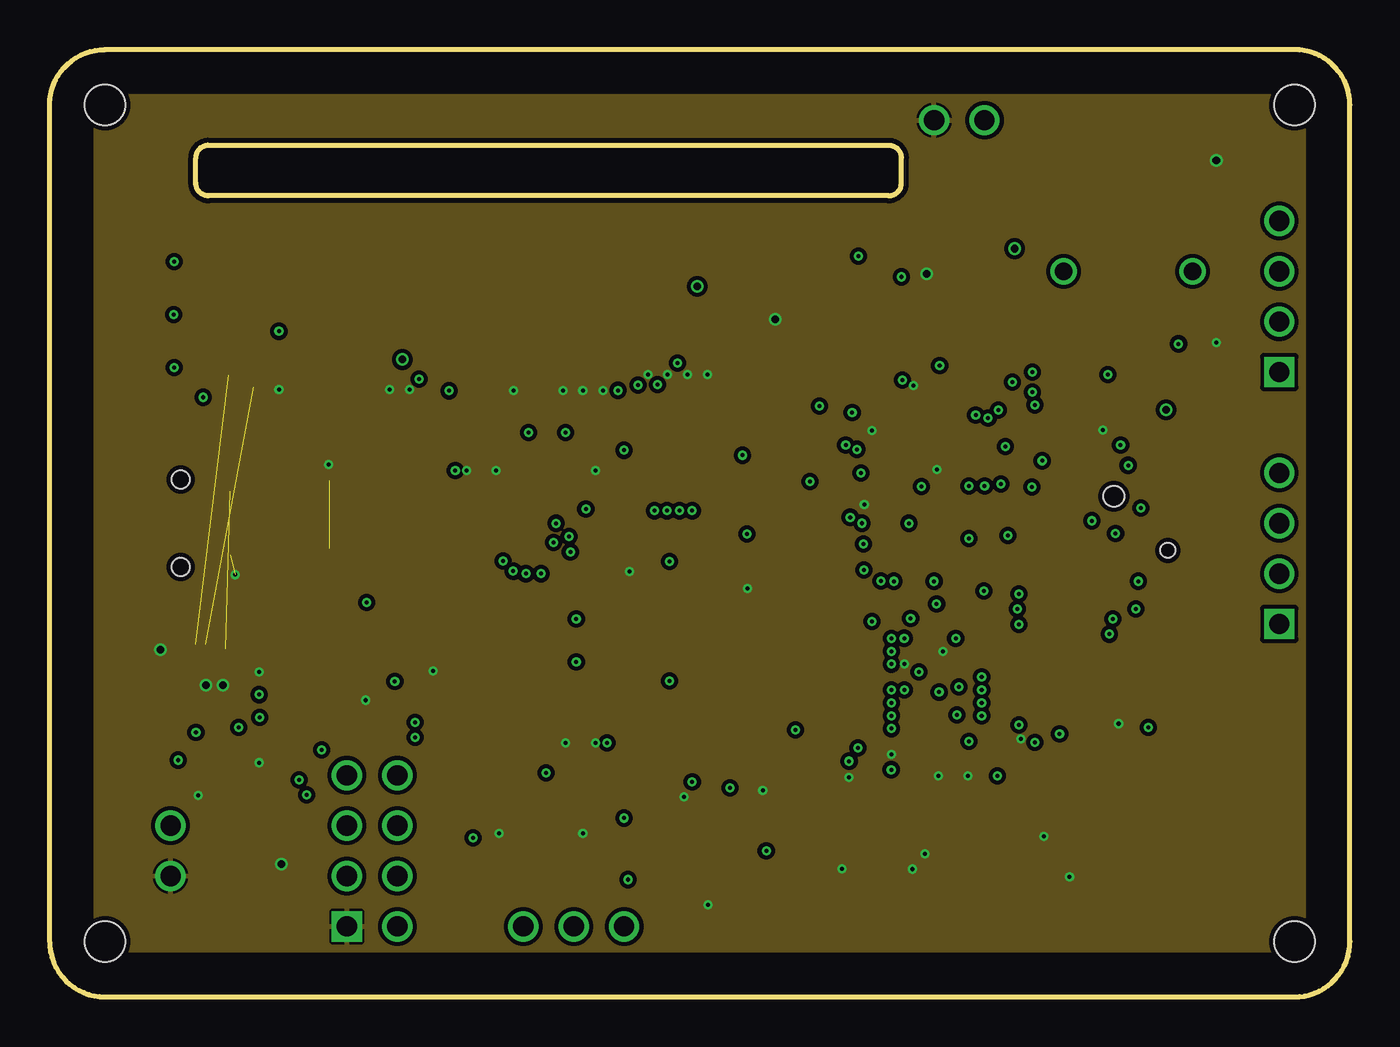
[diagram p5: board, inner layer Route2]
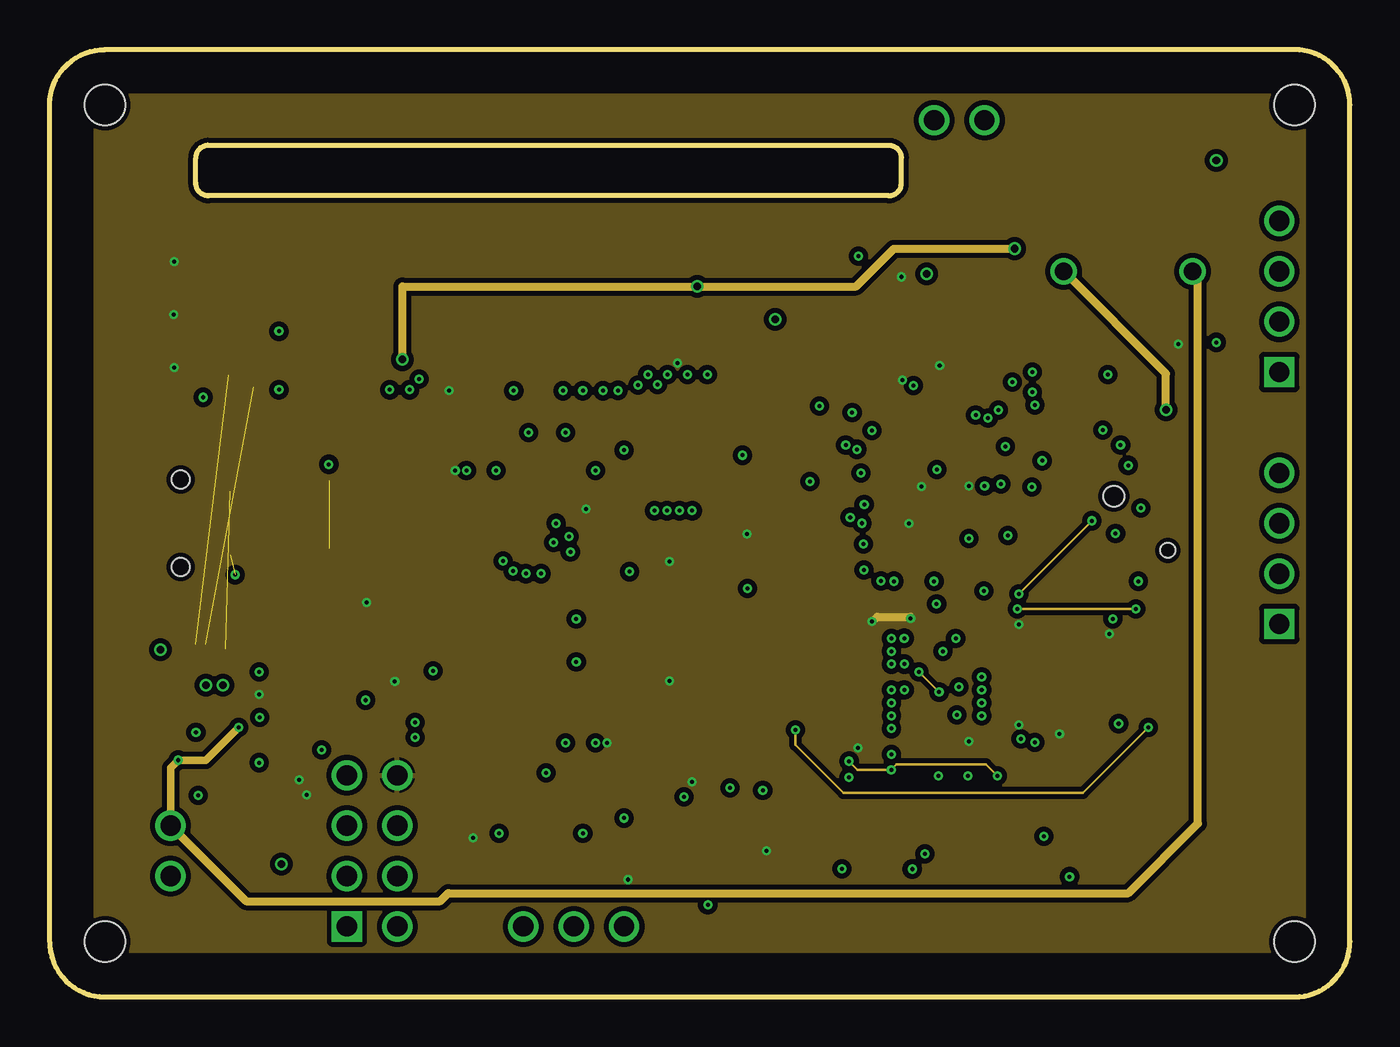
[diagram p6: board, inner layer Route15]
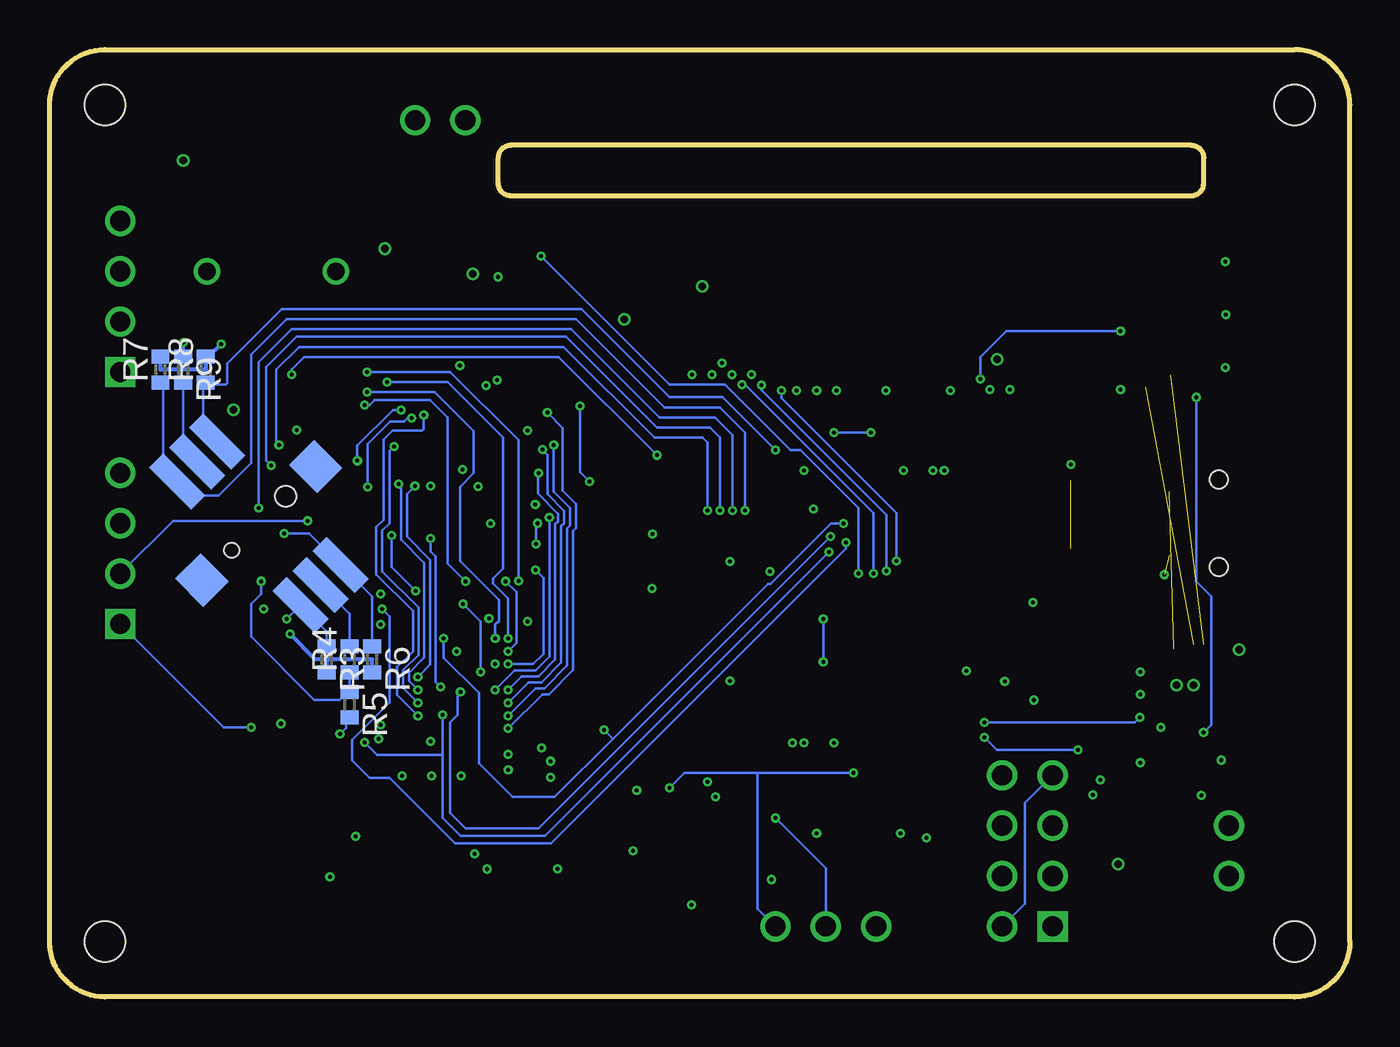
[diagram p7: board, bottom side, seen from below]

Size 65.53 x 47.75 mm. Coordinates in mm from the lower left corner, seen from the top.
Outline: 2.79,0 62.74,0 arc90 65.53,2.79 65.53,44.96 arc90 62.74,47.75 2.79,47.75 arc90 0,44.96 0,2.79 arc90 2.79,0
Outline: 42.29,42.93 arc-90 42.93,42.29 42.93,41.02 arc-90 42.29,40.39 8,40.39 arc-90 7.37,41.02 7.37,42.29 arc-90 8,42.93 42.29,42.93
Copper layers (1*16): Top 0.035mm / dielectric 1.5mm / Bottom 0.035mm
Design rules "default *": minimum track width 4mil, minimum drill 8mil, track to track 4mil, track to pad 4mil, pad to pad 4mil, via to via 4mil, smd to smd 0mil, copper to edge 10mil, drill to drill 8mil, minimum pad ring 4mil, minimum via ring 5mil, stop-mask expansion 0mil, vias tented up to drill 15mil, thermal gap 5mil
Holes 2.03 mm at 2.79,2.79 2.79,44.96 62.74,44.96 62.74,2.79

### Footprints (pad centres in the part's own frame; a part is rotated, then mirrored left to right if it is on the bottom)
C0402 = smd 0.7 x 0.9: 1 -0.65,0; 2 0.65,0
C0805@1 = smd 1.3 x 1.5: 1 -0.95,0; 2 0.95,0
C1206 = smd 1.6 x 1.8: 1 -1.4,0; 2 1.4,0
SOD-323 = smd 0.63 x 0.83: 1 -1.15,0; 2 1.15,0
LED-0603 = smd 0.8 x 0.8: A 0,-0.75; C 0,0.75
1X02 = drill 1.016 round: 1 0,0; 2 2.54,0
PSON10-V3 = smd 0.85 x 0.28: P$1 -1.475,1; P$2 -1.475,0.5; P$3 -1.475,0; P$4 -1.475,-0.5; P$5 -1.475,-1; P$6 1.475,-1; P$7 1.475,-0.5; P$8 1.475,0; P$9 1.475,0.5; P$10 1.475,1
1X04 = drill 1.016 square: 1 0,0 | drill 1.016 round: 2 2.54,0; 3 5.08,0; 4 7.62,0
1X08 = drill 1.016 square: 1 0,0 | drill 1.016 round: 2 0,-2.54; 3 2.54,0; 4 2.54,-2.54; 5 5.08,0; 6 5.08,-2.54; 7 7.62,0; 8 7.62,-2.54
R0402 = smd 0.7 x 0.9: 1 -0.65,0; 2 0.65,0
L1812 = smd 1.9 x 3.4: 1 -1.95,0; 2 1.95,0
CRYSTAL-SMD-5X3 = smd 1.9 x 1.1: 1 -1.85,-1.15; 2 1.85,-1.15; 3 1.85,1.15; 4 -1.85,1.15
SOT23-3 = smd 0.8 x 0.9: 1 -0.95,-1; 2 0.95,-1; 3 0,1.1
SOT23 = smd 1 x 1.4: 1 -0.95,-1.1; 2 0.95,-1.1; 3 0,1.1
PUSHBUTTON-KMR241GLFS = smd 1 x 1: P$1 2.1,0.8; P$2 2.1,-0.8; P$3 -2.1,0.8; P$4 -2.1,-0.8
BUZZER-12MM = drill 0.9 round: + 3.25,0; - -3.25,0
96-TFBGA-VER3 = smd 0.203 x 0.203: A$1 0.75,7.25; A$2 1.4,7.25; A$3 2.05,7.25; A$4 2.7,7.25; A$5 3.35,7.25; A$6 4,7.25; A$7 4.65,7.25; A$8 5.3,7.25; A$9 5.95,7.25; A$10 6.6,7.25; A$11 7.25,7.25; B$1 0.75,6.6; B$2 1.4,6.6; B$3 2.05,6.6; B$4 2.7,6.6; B$5 3.35,6.6; B$6 4,6.6; B$7 4.65,6.6; B$8 5.3,6.6; B$9 5.95,6.6; B$10 6.6,6.6; B$11 7.25,6.6; C$1 0.75,5.95; C$2 1.4,5.95; C$3 2.05,5.95; C$4 2.7,5.95; C$5 3.35,5.95; C$6 4,5.95; C$7 4.65,5.95; C$8 5.3,5.95; C$9 5.95,5.95; C$10 6.6,5.95; C$11 7.25,5.95; D$1 0.75,5.3; D$2 1.4,5.3; D$3 2.05,5.3; D$9 5.95,5.3; D$10 6.6,5.3; D$11 7.25,5.3; E$1 0.75,4.65; E$2 1.4,4.65; E$3 2.05,4.65; E$9 5.95,4.65; E$10 6.6,4.65; E$11 7.25,4.65; F$1 0.75,4; F$2 1.4,4; F$3 2.05,4; F$9 5.95,4; F$10 6.6,4; F$11 7.25,4; G$1 0.75,3.35; G$2 1.4,3.35; G$3 2.05,3.35; G$9 5.95,3.35; G$10 6.6,3.35; G$11 7.25,3.35; H$1 0.75,2.7; H$2 1.4,2.7; H$3 2.05,2.7; H$9 5.95,2.7; H$10 6.6,2.7; H$11 7.25,2.7; J$1 0.75,2.05; J$2 1.4,2.05; J$3 2.05,2.05; J$4 2.7,2.05; J$5 3.35,2.05; J$6 4,2.05; J$7 4.65,2.05; J$8 5.3,2.05; J$9 5.95,2.05; J$10 6.6,2.05; J$11 7.25,2.05; K$1 0.75,1.4; K$2 1.4,1.4; K$3 2.05,1.4; K$4 2.7,1.4; K$5 3.35,1.4; K$6 4,1.4; K$7 4.65,1.4; K$8 5.3,1.4; K$9 5.95,1.4; K$10 6.6,1.4; K$11 7.25,1.4; L$1 0.75,0.75; L$2 1.4,0.75; L$3 2.05,0.75; L$4 2.7,0.75; L$5 3.35,0.75; L$6 4,0.75; L$7 4.65,0.75; L$8 5.3,0.75; L$9 5.95,0.75; L$10 6.6,0.75; L$11 7.25,0.75
48-TFBGA = smd 0.203 x 0.203: A$1 1,6.8; A$2 1.8,6.8; A$3 2.6,6.8; A$4 3.4,6.8; A$5 4.2,6.8; A$6 5,6.8; B$1 1,6; B$2 1.8,6; B$3 2.6,6; B$4 3.4,6; B$5 4.2,6; B$6 5,6; C$1 1,5.2; C$2 1.8,5.2; C$3 2.6,5.2; C$4 3.4,5.2; C$5 4.2,5.2; C$6 5,5.2; D$1 1,4.4; D$2 1.8,4.4; D$3 2.6,4.4; D$4 3.4,4.4; D$5 4.2,4.4; D$6 5,4.4; E$1 1,3.6; E$2 1.8,3.6; E$3 2.6,3.6; E$4 3.4,3.6; E$5 4.2,3.6; E$6 5,3.6; F$1 1,2.8; F$2 1.8,2.8; F$3 2.6,2.8; F$4 3.4,2.8; F$5 4.2,2.8; F$6 5,2.8; G$1 1,2; G$2 1.8,2; G$3 2.6,2; G$4 3.4,2; G$5 4.2,2; G$6 5,2; H$1 1,1.2; H$2 1.8,1.2; H$3 2.6,1.2; H$4 3.4,1.2; H$5 4.2,1.2; H$6 5,1.2
HHM1710D1 = smd 0.8 x 0.3: P$1 0.65,1.6; P$2 0.65,1; P$3 0.65,0.4; P$4 2.05,0.4; P$5 2.05,1; P$6 2.05,1.6
2450BP15B100E = smd 1.3 x 1: P$1 0,0.9; P$3 0,-0.9 | smd 1 x 0.35: P$2 1.2,0; P$4 -1.2,0
3.2X2.5XTAL = smd 1.8 x 1.6: P$1 -1.5,-1; P$2 1.5,-1; P$3 1.5,1; P$4 -1.5,1
ANTENNA-CHIP2 = smd 1.7 x 1: FEED 0,1.25; P$2 0,-1.25
JS1200ABQ = smd 3 x 1: P$1 -4.4,1.425; P$2 -4.4,0; P$3 -4.4,-1.425; P$4 4.4,1.425; P$5 4.4,0; P$6 4.4,-1.425 | smd 2 x 1.8: P$7 0,4.05; P$8 0,-4.05 | hole 0.75: 0,1.925 | hole 1.05: 0,-1.925
SOT23' = smd 0.8 x 0.9: 1 -0.95,-1; 2 0.95,-1; 3 0,1.1
SOT23-5 = smd 0.55 x 1.2: 1 -0.95,-1.3; 2 0,-1.3; 3 0.95,-1.3; 4 0.95,1.3; 5 -0.95,1.3
UG6028GDEAF01 = smd 0.25 x 1.1: P$1 -8.5,-2.014; P$2 -8,-2.014; P$3 -7.5,-2.014; P$4 -7,-2.014; P$5 -6.5,-2.014; P$6 -6,-2.014; P$7 -5.5,-2.014; P$8 -5,-2.014; P$9 -4.5,-2.014; P$10 -4,-2.014; P$11 -3.5,-2.014; P$12 -3,-2.014; P$13 -2.5,-2.014; P$14 -2,-2.014; P$15 -1.5,-2.014; P$16 -1,-2.014; P$17 -0.5,-2.014; P$18 0,-2.014; P$19 0.5,-2.014; P$20 1,-2.014; P$21 1.5,-2.014; P$22 2,-2.014; P$23 2.5,-2.014; P$24 3,-2.014; P$25 3.5,-2.014; P$26 4,-2.014; P$27 4.5,-2.014; P$28 5,-2.014; P$29 5.5,-2.014; P$30 6,-2.014; P$31 6.5,-2.014; P$32 7,-2.014; P$33 7.5,-2.014; P$34 8,-2.014; P$35 8.5,-2.014
LFCSP14 = smd 1.524 x 0.55: P$1 -1.555,2; P$2 -1.555,1.2; P$3 -1.555,0.4; P$4 -1.555,-0.4; P$5 -1.555,-1.2; P$6 -1.555,-2; P$8 1.555,-2; P$9 1.555,-1.2; P$10 1.555,-0.4; P$11 1.555,0.4; P$12 1.555,1.2; P$13 1.555,2 | smd 0.55 x 1.524: P$7 0,-2.555; P$14 0,2.555
TQFP-10X10-64 = smd 1.2 x 0.3: P$1 -5.936,3.75; P$2 -5.936,3.25; P$3 -5.936,2.75; P$4 -5.936,2.25; P$5 -5.936,1.75; P$6 -5.936,1.25; P$7 -5.936,0.75; P$8 -5.936,0.25; P$9 -5.936,-0.25; P$10 -5.936,-0.75; P$11 -5.936,-1.25; P$12 -5.936,-1.75; P$13 -5.936,-2.25; P$14 -5.936,-2.75; P$15 -5.936,-3.25; P$16 -5.936,-3.75; P$33 5.886,-3.75; P$34 5.886,-3.25; P$35 5.886,-2.75; P$36 5.886,-2.25; P$37 5.886,-1.75; P$38 5.886,-1.25; P$39 5.886,-0.75; P$40 5.886,-0.25; P$41 5.886,0.25; P$42 5.886,0.75; P$43 5.886,1.25; P$44 5.886,1.75; P$45 5.886,2.25; P$46 5.886,2.75; P$47 5.886,3.25; P$48 5.886,3.75 | smd 0.3 x 1.2: P$17 -3.75,-5.911; P$18 -3.25,-5.911; P$19 -2.75,-5.911; P$20 -2.25,-5.911; P$21 -1.75,-5.911; P$22 -1.25,-5.911; P$23 -0.75,-5.911; P$24 -0.25,-5.911; P$25 0.25,-5.911; P$26 0.75,-5.911; P$27 1.25,-5.911; P$28 1.75,-5.911; P$29 2.25,-5.911; P$30 2.75,-5.911; P$31 3.25,-5.911; P$32 3.75,-5.911; P$49 3.75,5.936; P$50 3.25,5.936; P$51 2.75,5.936; P$52 2.25,5.936; P$53 1.75,5.936; P$54 1.25,5.936; P$55 0.75,5.936; P$56 0.25,5.936; P$57 -0.25,5.936; P$58 -0.75,5.936; P$59 -1.25,5.936; P$60 -1.75,5.936; P$61 -2.25,5.936; P$62 -2.75,5.936; P$63 -3.25,5.936; P$64 -3.75,5.936
USB-MINIB = smd 2.5 x 0.5: D+ 2.5,0; D- 2.5,0.8; GND 2.5,-1.6; ID 2.5,-0.8; VBUS 2.5,1.6 | smd 2.5 x 2: GND@1 -3,-4.5; GND@2 -3,4.5; GND@3 2.5,4.5; GND@4 2.5,-4.5 | hole 0.9: 0,2.2; 0,-2.2
1X03 = drill 1.016 round: 1 0,0; 2 2.54,0; 3 5.08,0

### Placement (x,y rotation side)
C1  44.79,9.64 90 top
C2  40.29,9.64 90 top
C3  46.29,9.64 270 top
C4  52.88,6.07 0 top
C5  52.47,13.77 0 top
C6  48.45,7.8 0 top
C7  39.25,11.87 270 top
C8  44.88,30.81 180 top
C9  37.79,11.87 270 top
C10  49.19,9.64 270 top
C11  35.18,21.99 270 top
C12  1uF  [C0805@1]  33.7,22.02 270 top
C13  35.94,9.02 90 top
C14  8.26,7.37 270 top
C15  12.95,8.64 270 top
C16  5.59,12.57 270 top
C17  45.85,39.24 180 top
C18  39.75,32.38 180 top
C19  36.58,12.7 90 top
C20  33.78,19.43 180 top
C22  59.82,41.53 90 top
C29  14.73,26.04 0 top
C30  14.73,22.61 0 top
D1  47.24,36.58 270 top
D3  5.46,36.32 180 top
D4  5.46,33.66 180 top
D5  5.46,30.99 180 top
HIGHV  47.12,44.2 180 top
IC2  7.87,15.75 270 top
JP1  61.98,31.5 90 top
JP5  61.98,18.8 90 top
JTAG  14.99,3.56 90 top
L1  43.29,9.64 90 top
L2  41.79,9.64 90 top
L3  47.79,9.64 90 top
L4  45.21,33.15 180 top
LIPO  6.1,6.1 90 top
OSC  34.04,15.75 270 top
Q4  54.1,28.57 270 top
Q5  14.99,18.92 0 top
Q6  14.99,14.99 0 top
R1  5.59,15.62 270 top
R2  10.29,32 90 top
R3  51.56,17.02 270 bottom
R4  50.42,17.02 90 bottom
R5  50.42,14.73 270 bottom
R6  49.28,17.02 270 bottom
R7  59.94,31.62 90 bottom
R8  57.66,31.62 90 bottom
R9  58.8,31.62 270 bottom
R10  28.19,6.6 270 top
R11  30.99,11.05 0 top
R12  9.02,32 90 top
R13  7.75,32 90 top
R14  7.49,11.68 90 top
R15  8.64,11.68 270 top
R16  12.83,32 270 top
R17  11.56,32 270 top
R18  21.34,6.6 270 top
R19  14.73,21.46 180 top
R20  11.94,16.38 0 top
R21  11.94,17.53 180 top
R22  11.94,15.24 180 top
R23  11.94,14.1 0 top
R24  14.73,24.89 180 top
R25  14.73,23.75 180 top
R26  11.94,11.81 0 top
R27  11.94,12.95 180 top
R28  47.12,41.15 0 top
R29  44.58,41.15 0 top
RESET  24.77,6.6 0 top
SG1  54.36,36.58 0 top
U$1  48.7,11.15 90 top
U$2  40.72,29.55 270 top
U$3  46.94,8.21 180 top
U$4  41.7,6.45 90 top
U$5  52.62,9.9 90 top
U$6  38.06,6.83 0 top
U$7  54.99,23.88 135 bottom
U$8  MCP1700T  [SOT23']  10.67,8.64 90 top
U$9  44.2,36.45 90 top
U$10  25.15,31.5 0 top
U$11  32.38,7.37 90 top
UC2  24.26,19.68 180 top
X1  6.6,23.88 0 top
XL  28.96,3.56 180 top

### Tracks (layer width: path | path; a pad name or v marks a point on that pad's centre or on a via)
1.8V  (via drill 0.2)
  Top 0.127: U$1.E$11 44.37,18.09 44.37,13.93 44.76,13.54 46.98,13.54 | U$1.L$3 47.94,13.2 47.6,13.54 46.98,13.54 | 46.98,13.54 46.98,12.23 U$1.J$1 46.65,11.55 47.06,11.14 v47.77,11.14 47.77,10.32 | L3.2 47.72,10.29 | C6.1 47.8,7.82 48.49,8.52 48.49,9.7 47.9,10.29 L3.2 | C9.1 39.22,12.52 39.23,12.54 C7.1 39.95,12.52 40.3,12.18 v40.3,11.89 | U$1.C$1 42.41,11.58 v42.41,11.46 | 47.77,10.32 47.79,10.32 L3.2 | 47.77,10.32 47.76,10.32
  Route15 0.127: v40.3,11.89 40.73,11.46 v42.41,11.46 42.69,11.73 47.19,11.73 v47.77,11.14
3.3V  (via drill 0.2)
  Top 0.127: v43.4,19.07 v43.4,19.08 U$1.D$11 | U$1.A$11 v41.45,18.92 v41.45,18.93 | U$1.L$11 48.38,18.41 v48.84,18.77 | U$1.L$4 48.51,13.85 v48.84,13.72 | U$1.A$2 v40.75,12.55 v40.74,12.56 | U$1.H$2 v46.33,12.88 | UC2.P$13 31.23,21.93 v31.24,21.95 | UC2.P$19 27.01,24.61 v27.03,24.59 | UC2.P$1 v31.23,15.94 v31.24,15.93 | C11.1 35.18,23.31 v35.15,23.34 34.07,23.34 C12.1 | UC2.P$64 28.01,12.89 v28.09,12.8 | R11.2 32.18,11.05 v32.38,10.85 | v36.12,7.37 U$11.P$7 | C13.1 36.12,8.19 v36.12,7.37 | U$11.P$6 36.12,5.81 v36.12,7.37 | U$11.P$1 29.16,5.81 v29.16,5.92 29.16,5.95 R10.2 | R18.1 v21.34,8.03 | UC2.P$48 17.4,15.94 v17.4,15.9 | R22.2 v10.57,15.24 | Q5.3 15.12,19.89 v15.98,19.89 | UC2.P$32 20.51,26.48 v20.45,26.54 | U$10.P$8 v20.15,30.56 v20.14,30.56 | D4.A 6.24,34.41 v6.25,34.39 | D3.A 6.26,37.07 v6.27,37.06 | D5.A 6.26,31.74 v6.27,31.73 | U$10.P$31 v31.65,31.95 | C8.1 45.53,31.83 v44.86,31.83 | U$2.G$4 42.94,26.15 43.31,25.78 43.89,25.78 v43.94,25.73 | U$2.B$4 v46.33,25.76 | U$2.F$6 43.52,24.09 v43.31,23.88
  Top 0.381: U$8.2 12.51,9.59 12.83,9.27 12.94,9.27 C15.1
  Top 0.406: U$9.5 42.93,35.47 42.93,34.16 43.05,34.04 43.05,33.27 43.18,33.15 L4.2 42.98,32.86 v42.98,31.09 | C15.1 v12.95,10.19 | 42.93,35.51 v42.93,36.3
  Top 0.61: C18.1 42.5,32.38 L4.2
  Route15 0.127: v43.4,19.08 43.41,19.09 | v48.84,18.77
  Route15 0.4: v43.38,19.08 v43.4,19.08 43.4,19.17 41.7,19.17 41.45,18.92 v41.45,18.93
  Bottom 0.127: R5.2 50.6,13.9 50.6,13.56 v50.9,13.26
  Bottom 0.203: R6.2 49.28,17.02 51.51,17.02 | 51.51,17.02 52.15,17.02 v53.42,18.29 | R3.2 51.56,16.97 51.51,17.02 | v56.9,32.92 57.54,32.27 R8.2 57.66,31.62 59.94,31.62 R7.2
  other vias: 12.57,10.95
  pour Route15 (isolate 0.254): 2.29,45.47 63.25,45.47 63.25,2.29 2.29,2.29
+5V  (1 unrouted)
  Top 0.203: IC2.P$2 8.37,17.55 8.87,17.55 | 8.87,17.55 IC2.P$1 | X1.VBUS 10.29,25.48 | R21.2 11.29,17.55 10.08,17.55 | 10.08,17.55 8.87,17.55 | R15.2 8.88,11.03 10.08,12.24 10.08,12.93 | 10.08,12.93 10.08,17.55 | R27.2 11.26,12.93 10.08,12.93
+15V  (via drill 0.38)
  Top 0.203: U$10.P$33 v32.65,35.81 v32.64,35.81 | U$10.P$3 17.65,32 v17.78,32.13
  Top 0.406: HIGHV.1 47.77,43.55 R28.2 47.77,39.76 C17.1 arc90 C17.1 D1.1 v48.63,37.73 v48.64,37.72
  Route15 0.406: v48.64,37.72 42.55,37.72 40.64,35.81 v32.64,35.81 17.78,35.81 v17.78,32.13
BC_SPI_CSB  (via drill 0.2)
  Top 0.127: U$1.C$11 42.75,20.12 v41.91,20.97 | v49.53,31.5 52.45,34.42 59.82,34.42 JP1.3
  Bottom 0.127: v41.91,20.97 41.91,28.06 45.34,31.5 v49.53,31.5
BC_SPI_MISO  (via drill 0.2)
  Top 0.127: U$1.C$9 v42.42,17.43 | v42.42,17.43 | v42.55,20.95 v44.58,20.95 | v49.66,29.84 53.21,33.4 60.2,33.4 61.98,31.62 JP1.1
  Bottom 0.127: v42.42,17.43 42.01,17.85 42.01,20.41 v42.55,20.95 | v44.58,20.95 45.47,21.84 45.47,29.21 46.35,30.1 49.15,30.1 49.4,29.84 v49.66,29.84
BC_SPI_MOSI  (via drill 0.2)
  Top 0.127: U$1.D$10 43.4,17.77 v43.07,18.08 | v49.53,30.48 53.09,34.04 JP1.2
  Bottom 0.127: v43.07,18.08 43.07,18.77 42.88,18.96 42.88,20.01 44.85,21.98 44.85,25.72 44.16,26.42 44.16,28.52 46.12,30.48 v49.53,30.48
BC_SPI_SCK  (via drill 0.2)
  Top 0.127: U$1.C$10 v42.42,18.08 | v48.51,30.99 48.51,31.37 51.94,34.8 57.66,34.8 JP1.4
  Bottom 0.127: v42.42,18.08 42.42,20.08 43.18,20.83 43.18,21.08 42.67,21.59 42.67,28.19 45.47,30.99 v48.51,30.99
BC_UART_CTS  (via drill 0.2)
  Top 0.127: UC2.P$34 25.32,22.93 v25.4,22.91 | U$1.J$11 46.65,18.96 47.24,19.56 v48.77,19.56 | JP5.3 59.05,23.88 v54.74,19.56
  Route15 0.127: v48.77,19.56 v54.74,19.56
  Bottom 0.127: v25.4,22.91 25.4,22.61 40.26,7.75 45.09,7.75 48.39,11.05 49.4,11.05 50.29,11.94 50.29,12.95 48.39,14.86 48.39,19.18 v48.77,19.56
BC_UART_RTS  (via drill 0.2)
  Top 0.127: UC2.P$35 v26.25,22.43 | v45.72,14.22 45.34,14.61 45.34,15.88 46,16.53 U$1.H$9 | JP5.4 63.25,25.15 63.25,23.37 62.48,22.61 59.44,22.61 v49.66,12.83
  Bottom 0.127: v26.25,22.43 40.55,8.13 44.83,8.13 45.72,9.02 45.72,12.19 | 45.72,12.19 v45.72,14.22 | v49.66,12.83 49.02,12.19 45.72,12.19
BC_UART_RX  (via drill 0.2)
  Top 0.127: UC2.P$29 22.01,24.48 22.61,23.88 v25.53,23.88 | U$1.H$10 45.7,18.06 v45.67,18.07
  Route15 0.127: v55.37,13.59 52.07,10.29 40.01,10.29 37.59,12.7 v37.59,13.46
  Bottom 0.127: v45.67,18.07 45.67,17.08 43.89,15.32 43.89,11.79 42.19,10.08 40.08,10.08 37.15,13.02 | 37.15,13.02 29.34,20.83 29.21,20.83 26.16,23.88 v25.53,23.88 | JP5.1 56.77,13.59 v55.37,13.59 | 37.15,13.02 v37.59,13.46
BC_UART_TX  (via drill 0.2)
  Top 0.127: UC2.P$30 21.51,24.34 22.48,23.37 26.04,23.37 v26.19,23.22 | U$1.G$9 45.35,16.65 44.83,16.13 v44.83,15.37 | v48.84,20.32 48.13,20.32 47.37,21.08 45.97,21.08 v44.7,19.81
  Route15 0.127: v48.84,20.32 v52.53,24 | v44.83,15.37 v43.81,16.38
  Bottom 0.127: v26.19,23.22 40.89,8.51 44.58,8.51 45.34,9.27 45.34,13.84 44.96,14.22 44.96,15.24 v44.83,15.37 | v52.53,24 59.31,24 JP5.2 | v44.7,19.81 43.81,18.92 v43.81,16.38
BUZZER  (via drill 0.2)
  Top 0.127: UC2.P$61 26.51,16.86 v26.54,16.89 | v26.54,19.05 26.54,21.46 30.35,25.27 32.89,25.27 v34.92,27.3 | Q4.1 53.34,29.65 v53.34,31.37
  Bottom 0.127: v26.54,16.89 v26.54,19.05 | v34.92,27.3 39.88,32.26 52.7,32.26 53.34,31.62 v53.34,31.37
DISC  (via drill 0.2)
  Top 0.127: UC2.P$53 22.51,14.7 21.84,15.37 19.94,15.37 v18.41,13.84 | R23.1 v10.59,14.1
  Bottom 0.127: v18.41,13.84 10.85,13.84 v10.59,14.1
GND  (via drill 0.2, 0.2 pad 0.46, 0.38)  (2 unrouted)
  Top 0.127: U$2.D$4 45.12,26.17 v44.71,26.58 | 41.43,28.55 v41.43,28.56 v41.44,28.56 | U$2.H$1 41.43,28.55 | 41.43,28.55 41.42,28.55 | v41.05,24.82 41.08,24.82 41.09,24.84 41.39,24.55 U$2.H$6 | U$1.A$1 41.77,12.23 v42.42,12.23 43.06,12.23 U$1.D$2 | U$1.E$2 44.04,12.55 44.03,12.56 | U$1.E$2 U$1.F$2 45.02,12.23 45.67,12.23 U$1.H$1 | U$1.D$2 U$1.E$2 | U$1.D$2 | U$1.D$2 | C3.1 | C3.1 | v46.28,11.14 C3.1 | v44.78,11.14 v44.78,11.15 v44.79,11.14 C1.2 | v40.28,11.08 40.28,11.1 40.29,11.09 C2.2 v40.29,11.09 39.25,11.09 | C6.2 49.05,7.85 49.05,8.1 v50.1,8.1 v50.09,8.11 50.07,8.11 C10.2 | 51.37,6.07 v51.41,6.07 C4.1 | C4.1 | U$4.P$1 40.95,6.46 | U$4.P$1 | v39.92,6.46 U$4.P$1 | 43.52,6.45 v43.48,6.45 U$4.P$3 | v44.1,7.22 44.02,7.22 | v44.1,7.22 v44.12,7.21 | U$3.P$5 v44.1,7.22 | 53.94,13.78 v53.88,13.78 C5.2 | 39.25,11.09 39.2,11.09 | 37.79,11.09 C9.2 | 39.25,11.09 C7.2 | 37.79,11.09 39.25,11.09 | U$1.D$9 | U$1.D$9 | v43.08,16.78 U$1.D$9 | U$1.J$10 46.32,17.43 v45.02,17.43 | 33.51,21.06 C12.2 33.5,21.01 33.41,20.93 33.74,20.6 v35.17,20.6 35.08,20.54 | 35.08,20.54 35.05,20.58 | C11.2 35.18,20.53 35.08,20.54 | U$1.K$3 47.61,12.89 48.55,12.89 48.66,13.01 v48.96,13.01 | C8.2 v43.54,30.81 | UC2.P$31 v21.01,26.54 | U$10.P$15 23.65,30.3 v23.39,30.56 23.11,30.28 23.11,29.48 U$10.P$14 | U$10.P$2 v17.15,30.61 v17.14,30.61 | U$10.P$4 v18.15,30.62 v18.14,30.61 | U$10.P$19 25.65,30.29 v25.88,30.56 26.15,30.31 U$10.P$20 | U$10.P$21 26.65,30.27 v26.87,30.56 27.15,30.32 U$10.P$22 | U$10.P$23 27.65,30.29 v27.89,30.56 28.15,30.3 U$10.P$24 | U$10.P$28 v30.15,31.37 | U$10.P$30 31.15,31.39 v31.14,31.37 | U$10.P$32 32.15,31.38 v32.16,31.37 | U$10.P$34 v33.15,31.37 | UC2.P$28 v22.51,26.54 v22.5,26.54
  Top 0.127: UC2.P$18 v27.51,26.54 | UC2.P$12 v29.24,21.43 v29.23,21.44 | UC2.P$63 v27.51,12.8 | UC2.P$60 v26.01,12.8 | UC2.P$47 v19.33,16.43 | C30.1 13.75,22.28 | C29.1 14.08,26.84 v14.07,26.85 | R17.2 v11.56,30.61 | 6.87,17.5 IC2.P$5 | 37.79,11.09 37.05,11.09 36.58,11.56 C19.1 | C13.2 v35.94,10.41 | Q4.2 53.1,28.56 v53.09,28.57
  Top 0.203: R20.1 v10.57,16.38 | R14.1 v7.49,10.16 | R26.1 v10.57,11.81 | Q6.2 v15.94,14.96 v15.93,14.96 | C20.1 35.17,20.17 v35.17,20.6 | RESET.P$3 22.66,7.41 v22.66,8.26 | RESET.P$1 26.87,7.41 v26.87,8.26 | 32.78,4.65 U$11.P$4 | 32.78,4.65 v33.17,4.65 33.59,4.65 U$11.P$5 | U$11.P$2 31.18,4.65 32.78,4.65 | U$11.P$12 31.18,10.08 v31.98,10.08 32.78,10.08 U$11.P$10
  Top 0.254: 6.87,17.5 v5.59,17.5 R1.1
  Top 0.381: C14.2 6.72,6.72 LIPO.1 | C15.2 12.83,8 12.51,7.69 U$8.1 11.67,6.72 v11.68,6.71
  Top 0.406: U$9.2 v44.2,36.45 44.2,39.24 C17.2 43.93,39.24 R29.1 43.93,43.55 HIGHV.2 | C18.2 v36.58,34.16 | C22.2 58.82,42.18 v58.8,42.16
  Bottom 0.203: R9.1 v58.8,32.99
  other vias: 9.35,21.29 7.87,15.72 8.74,15.72
  pour Route2 (isolate 0.203): 2.29,45.47 63.25,45.47 63.25,2.29 2.29,2.29
JS-DOWN  (via drill 0.2)
  Top 0.127: UC2.P$15 30.94,22.93 31.11,23.11 v31.11,24.51 | v54.99,24.64 v53.72,23.37
  Bottom 0.127: R6.1 49.28,20.18 U$7.P$3 50.87,21.79 52.45,23.37 v53.72,23.37 | v31.11,24.51 31.11,28.32 32,29.21 34.8,29.21 39.24,33.66 53.34,33.66 54.99,32 v54.99,24.64
JS-LEFT  (via drill 0.2)
  Top 0.127: UC2.P$11 31.73,20.93 32.08,21.29 32.08,23.32 32.38,23.62 v32.38,24.51 | v53.98,27.81 54.1,27.81 56.13,25.78 56.13,23.39 55.5,22.76 55.5,20.95 v53.59,19.05
  Bottom 0.127: R3.1 51.56,18.43 U$7.P$1 v53.59,19.05 | v32.38,24.51 32.38,27.94 32.64,28.19 35.05,28.19 39.62,32.77 52.96,32.77 54.1,31.62 54.1,27.94 v53.98,27.81 | v53.59,19.05
JS-PUSH  (via drill 0.2)
  Top 0.127: UC2.P$14 31.2,22.43 31.75,22.99 v31.75,24.51 | v54.36,26.8 55.63,25.53 55.63,23.38 54.86,22.62 v54.86,20.95
  Bottom 0.127: v31.75,24.51 31.75,28.19 32.26,28.7 34.92,28.7 39.5,33.27 53.09,33.27 54.61,31.75 54.61,27.05 v54.36,26.8 | v54.86,20.95 54.86,20.32 55.37,19.81 55.37,18.16 52.2,14.99 50.93,14.99 50.55,15.37 50.43,15.37 R5.1 R4.1
JS-RIGHT  (via drill 0.2)
  Top 0.127: UC2.P$17 28.01,26.61 v28.96,27.56
  Bottom 0.127: 57.78,30.99 57.77,30.97 R8.1 | U$7.P$6 57.78,28.68 57.78,30.99 | 57.78,30.99 57.53,30.99 57.53,30.86 56.67,30.86 56.59,30.94 56.59,31.93 53.85,34.67 38.73,34.67 34.29,30.23 31.62,30.23 v28.96,27.56
JS-UP  (via drill 0.2)
  Top 0.127: v30.48,24.51 30.48,23.5 30.25,23.5 UC2.P$16
  Bottom 0.127: R7.1 59.83,30.97 59.82,30.99 59.82,26.69 U$7.P$4 58.4,25.27 57.02,25.27 55.37,26.92 55.37,32.38 53.59,34.16 38.99,34.16 34.54,29.72 31.75,29.72 30.48,28.45 v30.48,24.51
JTAG-TCK
  Top 0.127: JTAG.4 16.38,7.24 16.38,9.14 17.14,9.91 18.16,9.91 20.51,12.25 UC2.P$49
JTAG-TDI
  Top 0.127: UC2.P$50 21.01,12.12 JTAG.6
JTAG-TDO
  Top 0.127: JTAG.3 16.26,4.83 18.16,4.83 19.05,5.71 19.05,7.87 23.51,12.33 UC2.P$55
JTAG-TMS
  Top 0.127: JTAG.5 16.26,9.91 16.26,11.94 16.76,12.45 16.76,16.51 17.19,16.93 UC2.P$46
JTAG-TRST
  Top 0.127: JTAG.2 19.92,5.95 R18.2 21.49,5.8 RESET.P$4 23.58,5.8 24.01,6.23 UC2.P$56 24.01,15.37 27.57,18.93 UC2.P$7
  Bottom 0.127: JTAG.7 16.38,9.78 16.38,4.7 JTAG.2
N$1  (via drill 0.2 pad 0.46)
  Top 0.127: U$1.C$3 v42.42,13.53 | U$2.G$1 42.72,28.8 42.07,29.45 v40.45,29.45
  Bottom 0.127: 42.4,13.55 42.35,13.6 | v40.45,29.45 39.67,28.68 39.67,25.53 39,24.85 39,23.63 39.15,23.48 39.15,16.48 40.37,15.25 40.7,15.25 42.4,13.55 | v42.42,13.53 42.4,13.55
N$2
  Top 0.127: U$1.B$3 41.77,13.53 38.82,13.53 36.32,16.03 36.32,26.03 39.65,29.35 39.65,29.78 40.05,30.18 42.32,30.18 43.52,28.98 U$2.F$1
N$3  (via drill 0.2 pad 0.46)
  Top 0.127: U$1.J$6 v46.97,15.48 | U$2.A$4 47.65,26.15 v47.95,25.85
  Bottom 0.127: 47.02,15.53 v46.97,15.48 47.42,15.93 47.42,16.33 46.65,17.1 46.65,21.88 47.82,23.05 47.82,25.73 v47.95,25.85
N$4
  Top 0.127: U$1.A$3 38.65,13.2 36.02,15.83 36.02,26.18 39.35,29.5 39.35,29.9 39.92,30.48 42.47,30.48 43.87,29.08 43.87,28.75 44.07,28.55 U$2.E$1
N$5
  Top 0.127: U$1.K$4 47.62,14.18 50.3,14.18 52.8,16.68 52.8,23.06 51.45,24.42 51.45,27.28 48.65,30.08 46.22,30.08 45.12,28.98 U$2.D$1
N$6  (via drill 0.2 pad 0.46)
  Top 0.127: U$1.J$4 v46.97,14.18 | U$2.C$1 45.92,28.75 46.5,29.33 v46.67,29.33
  Bottom 0.127: v46.97,14.18 48.02,15.23 48.02,16.63 47.22,17.43 47.22,19.45 49.07,21.3 49.07,23.68 48.7,24.05 48.7,28.1 48.25,28.55 46.75,28.55 46.67,28.63 v46.67,29.33
N$7
  Top 0.127: U$1.L$5 50.18,14.5 52.5,16.83 52.5,22.91 51.15,24.27 51.15,27.13 49.72,28.55 U$2.A$1
N$8
  Top 0.127: U$1.K$5 47.62,14.83 50.03,14.83 52.2,17 52.2,22.76 50.85,24.12 50.85,26.98 49.6,28.23 47.05,28.23 U$2.B$1
N$9
  Top 0.127: U$1.K$6 47.62,15.48 49.73,15.48 51.6,17.35 51.6,22.46 50.25,23.82 50.25,26.05 49.02,27.28 47.9,27.28 47.82,27.35 45.52,27.35 U$2.D$2
N$10  (via drill 0.2 pad 0.46)
  Top 0.127: U$1.L$6 49.88,15.15 51.9,17.18 51.9,22.61 50.55,23.97 50.55,26.5 v50.02,27.03 | U$2.C$2 45.52,28.15 45.52,28.95 46.35,29.78 47.62,29.78 v47.82,29.58
  Bottom 0.127: v50.02,27.03 50.02,27.8 48.22,29.58 v47.82,29.58
N$11  (via drill 0.2 pad 0.46)
  Top 0.127: U$1.J$5 v46.97,14.83 | v48.17,27.75 U$2.A$2
  Bottom 0.127: 47.02,14.88 v46.97,14.83 47.72,15.58 47.72,16.48 46.95,17.25 46.95,19.63 48.77,21.45 48.77,23.5 48.4,23.88 48.4,27.53 v48.17,27.75
N$12  (via drill 0.2 pad 0.46)
  Top 0.127: U$1.J$7 v46.97,16.13 | v47.12,25.75 U$2.B$5
  Bottom 0.127: 46.95,16.15 46.9,16.2 | v47.12,25.75 47.52,25.35 47.52,23.2 46.35,22.03 46.35,16.75 46.95,16.15 | v46.97,16.13 46.95,16.15
N$13
  Top 0.127: U$1.L$8 49.3,16.45 50.72,17.88 50.72,21.34 | U$2.A$5 48.12,25.35 48.37,25.1 48.37,24.36 50.72,22.01 50.72,21.34 | 50.72,21.34 50.72,21.35
N$14
  Top 0.127: U$1.K$8 47.62,16.78 49.17,16.78 50.42,18.03 50.42,21.85 48.07,24.2 48.07,24.95 46.5,24.95 46.1,25.35 U$2.C$5
N$15  (via drill 0.2 pad 0.46)
  Top 0.127: U$1.J$8 v45.82,15.63 | v46.32,23.1 46.32,24.6 45.97,24.95 45.52,24.95 U$2.D$5
  Bottom 0.127: v45.82,15.63 46.07,15.88 46.07,22.2 46.32,22.45 v46.32,23.1
N$16
  Top 0.127: U$1.L$9 49.05,17.1 50.12,18.18 50.12,21.05 49.02,22.15 47.62,22.15 46.85,22.93 46.85,23.4 46.72,23.53 U$2.B$6
N$17  (via drill 0.2 pad 0.46)
  Top 0.127: U$2.A$6 47.52,24.03 v48.3,23.25 | U$1.J$9 46.65,17.3 46.97,17.63 46.97,17.9 46.8,18.08 46.5,18.08 46.32,18.25 46.32,19.7 46.33,19.7 v47.09,20.47
  Bottom 0.127: v47.09,20.47 48.3,21.67 v48.3,23.25
N$18
  Top 0.127: U$1.K$9 47.62,17.43 48.92,17.43 49.82,18.33 49.82,20.9 48.87,21.85 46.67,21.85 45.8,22.73 45.8,23.35 45.92,23.48 U$2.C$6
N$19
  Top 0.127: U$1.L$10 48.8,17.75 49.52,18.48 49.52,20.75 48.72,21.55 46.52,21.55 45.12,22.95 U$2.D$6
N$20
  Top 0.127: U$1.A$10 40.47,17.75 39.92,18.3 39.92,21.38 40.77,22.23 43.57,22.23 44.32,22.98 U$2.E$6
N$21  (via drill 0.2 pad 0.46)
  Top 0.127: U$1.K$7 47.62,16.13 49.43,16.13 51,17.7 51,22.16 49.5,23.67 v49.5,25.7 | U$2.B$2 46.32,28.15 46.32,28.63 46.57,28.88 47,28.88 v47.3,29.18
  Bottom 0.127: v49.5,25.7 49.5,27.88 48.37,29 47.67,29 47.5,29.18 v47.3,29.18
N$22
  Top 0.127: U$1.L$7 49.58,15.8 51.3,17.53 51.3,22.31 49.95,23.67 49.95,25.9 49.3,26.55 46.32,26.55 U$2.C$3
N$23
  Top 0.127: U$1.A$4 39,13.85 36.62,16.23 36.62,25.9 39.95,29.23 39.95,29.65 40.17,29.88 42.17,29.88 43.12,28.93 43.12,28.38 43.35,28.15 43.72,28.15 44.12,27.75 U$2.E$2
N$24  (via drill 0.2 pad 0.46)
  Top 0.127: U$1.C$4 v42.42,14.18 | v40.12,27.83 40.34,28.04 40.89,28.04 41.18,27.75 U$2.H$2
  Bottom 0.127: 42.4,14.2 42.37,14.23 | v40.12,27.83 40.12,25.48 39.3,24.65 39.3,23.75 39.45,23.6 39.45,16.7 40.6,15.55 41.05,15.55 42.4,14.2 | v42.42,14.18 42.4,14.2
N$25  (via drill 0.2 pad 0.46)
  Top 0.127: U$1.B$5 41.77,14.83 39.55,14.83 37.52,16.85 37.52,20.5 | U$2.E$3 44.72,27.35 44.72,28.68 42.62,30.78 39.8,30.78 v38.8,29.78 | v38.32,25.98 37.52,25.18 37.52,20.5 | 37.52,20.5 37.52,20.53
  Bottom 0.127: v38.8,29.78 38.8,26.45 v38.32,25.98
N$26
  Top 0.127: U$1.A$6 39.72,15.15 37.82,17.05 37.82,24.6 40.37,27.15 41.37,27.15 41.57,26.95 U$2.H$3
N$27  (via drill 0.2 pad 0.46)
  Top 0.127: U$2.H$4 41.55,26.25 41.05,26.25 v40.9,26.4 | U$1.C$6 v42.42,15.48
  Bottom 0.127: 40.8,26.4 v40.9,26.4 40.92,26.38 40.92,25.38 39.9,24.35 39.9,23.98 40.05,23.83 40.05,17 40.9,16.15 41.75,16.15 v42.42,15.48
N$28  (via drill 0.2 pad 0.46)
  Top 0.127: U$2.E$4 44.72,25.75 44.72,22.9 43.35,21.53 v41.05,21.53 | U$1.B$7 42.1,15.95 42.42,16.28 v42.42,16.78
  Bottom 0.127: v41.05,21.53 40.65,21.13 40.65,17.3 41.17,16.78 v42.42,16.78
N$29
  Top 0.127: U$1.A$8 39.9,16.45 38.72,17.63 38.72,24.23 40.15,25.65 41.37,25.65 41.67,25.35 U$2.H$5
N$30  (via drill 0.2 pad 0.46)
  Top 0.127: U$1.A$9 40.2,17.1 39.32,17.98 39.32,22.48 40.72,23.88 v40.95,23.88 | v41.02,22.83 43.7,22.83 43.92,23.05 43.92,24.95 U$2.E$5
  Bottom 0.127: v40.95,23.88 41.02,23.8 v41.02,22.83
N$31
  Top 0.127: U$1.B$4 41.77,14.18 39.17,14.18 36.92,16.43 36.92,25.78 40.15,29 41.97,29 42.32,28.65 42.32,28.38 42.55,28.15 42.9,28.15 43.3,27.75 U$2.F$2
N$32
  Top 0.127: U$1.A$5 39.37,14.5 37.22,16.65 37.22,25.65 39.89,28.32 41.02,28.32 41.32,28.02 41.73,28.02 41.78,28.07 42.14,28.07 42.45,27.75 42.71,27.75 U$2.G$2
N$33  (via drill 0.2 pad 0.46)
  Top 0.127: U$1.C$5 v42.42,14.83 | v40.7,27.6 40.85,27.45 41.52,27.45 41.65,27.33 43.12,27.33 43.5,26.95 U$2.F$3
  Bottom 0.127: v42.42,14.83 41.4,15.85 40.75,15.85 39.75,16.85 39.75,23.73 39.6,23.88 39.6,24.5 40.45,25.35 40.45,27.33 v40.7,27.6
N$34
  Top 0.127: U$1.B$6 41.77,15.48 39.9,15.48 38.12,17.25 38.12,24.48 40.5,26.85 41.22,26.85 41.52,26.55 42.1,26.55 42.5,26.95 U$2.G$3
N$35
  Top 0.127: U$1.A$7 40.07,15.8 38.42,17.45 38.42,24.35 40.02,25.95 41.52,25.95 41.72,25.75 42.12,25.75 42.32,25.95 42.32,26.33 42.55,26.55 42.9,26.55 U$2.F$4
N$36  (via drill 0.2 pad 0.46)
  Top 0.127: U$2.G$5 42.72,25.15 42.32,24.75 42.32,24.33 42.12,24.13 41.4,24.13 41.17,24.35 40.52,24.35 v40.35,24.18 | 42.72,15.83 U$1.C$7 v43.07,15.48
  Bottom 0.127: v40.35,24.18 40.35,17.15 41.05,16.45 42.1,16.45 v43.07,15.48
N$37
  Top 0.127: U$1.B$8 41.77,16.78 40.05,16.78 39.02,17.8 39.02,24.08 40.3,25.35 41.25,25.35 41.65,24.95 42.07,24.95 42.32,25.2 42.32,25.5 42.55,25.73 42.85,25.73 43.23,25.35 U$2.F$5
N$38
  Top 0.127: U$1.B$9 41.77,17.43 40.35,17.43 39.62,18.15 39.62,22.33 40.67,23.38 42.25,23.38 42.72,23.85 42.72,24.18 | 42.72,24.18 42.72,24.15 | 42.72,24.18 U$2.G$6
N$39
  Top 0.127: L1.1 C1.1 44.88,8.99 46.06,7.81 U$3.P$3
N$40
  Top 0.127: U$1.F$1 43.81,11.02 43.28,11.02 43.3,11.01 L1.2 | L1.2 43.3,10.24 | L1.2
N$41
  Top 0.127: U$1.E$1 43.55,11.41 42.98,11.41 41.86,10.29 L2.2
N$42
  Top 0.127: C2.1 L2.1 42.63,8.15 44.3,8.15 44.63,7.81 U$3.P$4
N$43
  Top 0.127: 46.29,9 46.28,9.01 | 46.29,9 C3.2 46.4,8.99 47.05,8.34 47.05,7.21 U$3.P$2 | L3.1 C3.2 46.29,9
N$44
  Top 0.127: U$3.P$1 46.29,5.85 45.26,4.82 41.77,4.82 41.77,5.19 U$4.P$4
N$45
  Top 0.127: 53.53,8.4 53.52,8.42 | 53.53,8.4 U$5.P$1 53.62,8.54 52.27,9.9 50.73,9.9 50.23,10.4 50.23,11.14 49.52,11.84 | C4.2 53.53,8.4 | 49.52,11.84 49.48,11.89 | U$1.L$1 49.46,11.9 49.52,11.84
N$46
  Top 0.127: 51.27,11.86 51.27,11.81 51.35,11.73 | 51.35,11.73 51.66,11.42 51.65,11.4 U$5.P$3 51.82,11.61 C5.1 | U$1.L$2 48.18,12.32 50.76,12.32 51.35,11.73
N$47
  Top 0.127: U$1.K$2 47.62,12.23 47.62,11.73 47.77,11.58 48.55,11.58 49.19,10.95 C10.1 | C10.1 | C10.1 49.16,10.27
N$48
  Top 0.254: IC2.P$6 6.87,13.99 5.59,13.99 | 5.59,13.99 R1.2 | C16.1 5.59,13.99
N$49  (via drill 0.2)
  Top 0.127: v7.75,30.23 R13.1
  Top 0.203: IC2.P$7 v7.37,13.34
  Bottom 0.127: v7.37,13.34 6.99,13.72 6.99,20.19 7.75,20.95 v7.75,30.23
N$50
  Top 0.127: R13.2 7.13,32.65 6.73,32.26 6.73,30.73 6.22,30.23 5.45,30.23 | 5.45,30.23 5.33,30.23 | D5.C 5.45,30.23
N$51
  Top 0.127: R12.2 9.02,33.27 8.76,33.53 6.99,33.53 6.35,32.89 5.47,32.89 D4.C
N$52
  Top 0.127: R2.2 10.29,33.15 7.87,35.56 5.47,35.56 D3.C
N$53
  Top 0.127: UC2.P$5 31.34,17.93 31.62,17.65 31.62,16.64 32.51,15.75 33.78,15.75 35.18,14.35 OSC.3 35.73,13.35 C19.2
N$54
  Top 0.127: OSC.1 33.13,17.6 33.13,18.03 | 33.13,18.03 C20.2 | UC2.P$6 33.13,18.43 33.13,18.03
N$55
  Top 0.127: Q5.2 15.94,17.97 14.99,18.92 14.1,18.92 13.97,19.05 13.97,21.35 R19.2
N$56  (1 unrouted)
  Top 0.127: IC2.P$3 7.87,17.78 | R2.1 10.29,30.73
N$57  (1 unrouted)
  Top 0.127: 7.37,17.23 7.37,17.78
  Top 0.203: IC2.P$4 7.37,17.23
N$58
  Bottom 0.127: U$7.P$2 50.42,19.3 R4.2
N$59
  Top 0.406: L4.1 47.24,33.23 D1.2 arc90 47.17,35.5 U$9.1
N$60
  Top 0.127: R15.1 R14.2 7.87,12.33 IC2.P$8
N$61
  Top 0.406: U$9.3 45.85,37.4 45.85,40.51 | 45.85,40.51 R29.2 | 45.85,40.51 R28.1
N$62
  Top 0.127: U$6.FEED 38.05,8.09 | U$6.FEED | U$4.P$2 41.7,8.09 U$6.FEED
N$63  (via drill 0.2)
  Top 0.127: U$10.P$5 18.65,31.11 v18.62,31.14 | R17.1 v11.56,33.55
  Bottom 0.127: v18.62,31.14 18.62,32.26 17.32,33.55 v11.56,33.55 11.53,33.55
N$64  (via drill 0.38)
  Top 0.406: v56.26,29.59 55.24,28.57 Q4.3
  Route15 0.406: SG1.- 56.26,31.42 v56.26,29.59
N$66
  Bottom 0.127: U$7.P$5 58.8,27.69 R9.2
N$67
  Top 0.203: 13.99,17.53 R21.1 R20.2 | 13.99,17.53 13.99,16.2 14.96,16.2 14.96,16.09 Q6.3 | 13.99,17.53 13.99,17.82 Q5.1
N$69
  Top 0.203: Q6.1 14.04,14.1 R23.2 R22.1
N$70
  Top 0.127: UC2.P$44 17.37,17.93 17.27,18.03 17.27,20.19 16.26,21.21 16.26,24.38 16,24.64 15.64,24.64 R24.1
  Top 0.203: R24.1 C29.2
N$72
  Top 0.127: R19.1 15.37,21.45 15.37,21.34 16.89,19.81 16.89,17.78 17.24,17.43 UC2.P$45
  Top 0.203: R25.1 C30.2 R19.1
N$78
  Top 0.127: R16.2 12.95,31.34 12.95,31.32 13.72,30.56 15.85,30.56 16.51,31.22 16.51,32.38 17.04,32.92 18.09,32.92 19.15,31.86 U$10.P$6
OLED_CSB
  Top 0.127: UC2.P$20 26.51,26.39 28.55,28.43 28.95,28.43 29.15,28.63 U$10.P$26 29.15,29.5
OLED_DOTCLK
  Top 0.127: 22.13,29.41 22.12,29.4 22.15,29.37 | UC2.P$25 24.01,26.68 22.15,28.55 22.15,29.39 22.13,29.41 | 22.13,29.41 22.15,29.43 U$10.P$12
OLED_ENABLE
  Top 0.127: UC2.P$24 24.51,26.71 22.65,28.58 U$10.P$13
OLED_HSYNC
  Top 0.127: UC2.P$26 23.51,26.68 21.65,28.54 21.65,29.33 21.6,29.38 21.65,29.43 U$10.P$11
OLED_OSCA1
  Top 0.127: 12.93,32.56 12.92,32.56 R16.1 12.83,32.56 | U$10.P$7 19.65,32.17 18.34,33.48 13.03,33.48 12.83,33.27 12.83,32.82 12.85,32.79 12.85,32.59 12.83,32.56 | 12.83,32.56 12.8,32.54
OLED_RDB  (via drill 0.2)
  Top 0.127: UC2.P$37 23.21,21.43 v23.37,21.46 | v29.66,30.84 29.66,29.35 29.63,29.32 29.63,29.41 29.65,29.43 U$10.P$27
  Bottom 0.127: v23.37,21.46 23.36,22.74 23.36,24.3 29.66,30.6 v29.66,30.84
OLED_RESETB  (via drill 0.2)
  Top 0.127: UC2.P$38 23.6,20.93 v24,21.34 | 30.65,29.37 U$10.P$29 v30.65,30.87
  Bottom 0.127: v24,21.34 24,24.38 30.48,30.87 v30.65,30.87
OLED_RS  (via drill 0.2)
  Top 0.127: UC2.P$36 22.82,21.93 v22.86,21.97 | 28.65,29.47 U$10.P$25 | v28.65,30.58 28.65,29.47 | 28.65,29.47 28.66,29.46
  Bottom 0.127: v22.86,21.97 22.85,23.5 22.85,24.39 28.65,30.19 v28.65,30.58
OLED_SPI_MISO
  Top 0.127: UC2.P$22 25.51,27.55 25.15,27.91 25.15,29.43 25.14,29.44 25.15,29.45 U$10.P$18
OLED_SPI_MOSI
  Top 0.127: UC2.P$23 25.01,27.41 24.65,27.78 24.65,29.41 24.6,29.46 24.62,29.48 U$10.P$17
OLED_SPI_SCK  (via drill 0.2)
  Top 0.127: v24.15,28.46 U$10.P$16 | UC2.P$21 v26.01,28.46
  Bottom 0.127: v26.01,28.46 v24.15,28.46
OLED_VSYNC
  Top 0.127: UC2.P$27 23.01,26.68 21.15,28.55 21.15,29.46 21.17,29.48 U$10.P$10
OLED_VSYNCO
  Top 0.127: UC2.P$33 17.91,23.43 17.91,25.54 20.65,28.28 U$10.P$9
STEPUP_SHDN  (via drill 0.2)
  Top 0.127: UC2.P$39 23.86,20.43 v24.77,21.34 | U$9.4 40.83,37.4 v40.77,37.34
  Bottom 0.127: v24.77,21.34 24.77,24.64 27.69,27.56 28.19,27.56 31.5,30.86 34.29,30.86 v40.77,37.34
SUP  (via drill 0.2)
  Top 0.254: IC2.P$9 8.37,13.59 8.87,13.59 | 8.87,13.59 IC2.P$10 | 5.59,11.94 C16.2 | v9.53,13.59 8.87,13.59
  Top 0.381: v6.48,11.94 5.59,11.94 | LIPO.2 6.72,8.02 C14.1 8.88,8.64 U$8.3
  Top 0.406: SG1.+ 57.61,38.81 59.69,40.89 59.8,40.89 C22.1
  Route15 0.381: v9.53,13.59 7.87,11.94 v6.48,11.94 6.1,11.56 LIPO.2
  Route15 0.406: LIPO.2 9.91,4.83 19.68,4.83 20.09,5.23 54.36,5.23 57.88,8.75 57.88,36.31 SG1.+
USB_P  (via drill 0.2)
  Top 0.127: UC2.P$52 22.01,14.57 21.59,14.99 20.32,14.99 v18.41,13.08 | v13.72,12.45 13.34,12.83 12.57,12.83 12.59,12.81 R26.2
  Top 0.203: 12.57,12.83 12.59,12.83 R27.1
  Bottom 0.127: v18.41,13.08 17.78,12.45 v13.72,12.45
USBDM
  Top 0.127: 13.87,24.68 R24.2
  Top 0.203: X1.D- 13.87,24.68
USBDP
  Top 0.127: 13.96,23.88 R25.2
  Top 0.203: X1.D+ 13.96,23.88
XL_I2C_SCL
  Top 0.127: U$11.P$14 28.31,7.37 R10.1 28.19,9.14 27.11,10.22 | UC2.P$58 25.01,12.33 27.11,10.22 | XL.3 23.88,4.19 25.27,5.59 25.27,8.38 27.11,10.22
XL_I2C_SDA  (via drill 0.2)
  Top 0.127: UC2.P$59 25.51,12.34 26.8,11.05 R11.1 30.39,11 U$11.P$13 30.29,9.02 v28.96,9.02
  Bottom 0.127: XL.2 26.42,6.48 v28.96,9.02
XL_INT1  (via drill 0.2)
  Top 0.127: UC2.P$57 24.51,11.81 v25.02,11.3 | v34.29,10.54 34.38,10.45 U$11.P$8
  Bottom 0.127: 29.84,11.3 v25.02,11.3 | 29.84,11.3 33.53,11.3 v34.29,10.54 | XL.1 29.84,4.45 29.84,11.3
(copper drawn outside any net)
  shapes: Top area x1

### Text on the board
Top: CUT-OUT | CUT-OUT | CUT-OUT